# EAGLE schematic pdp8i (EAGLE 6.6.0), part 3 of 4
## Sheet 21 of 40
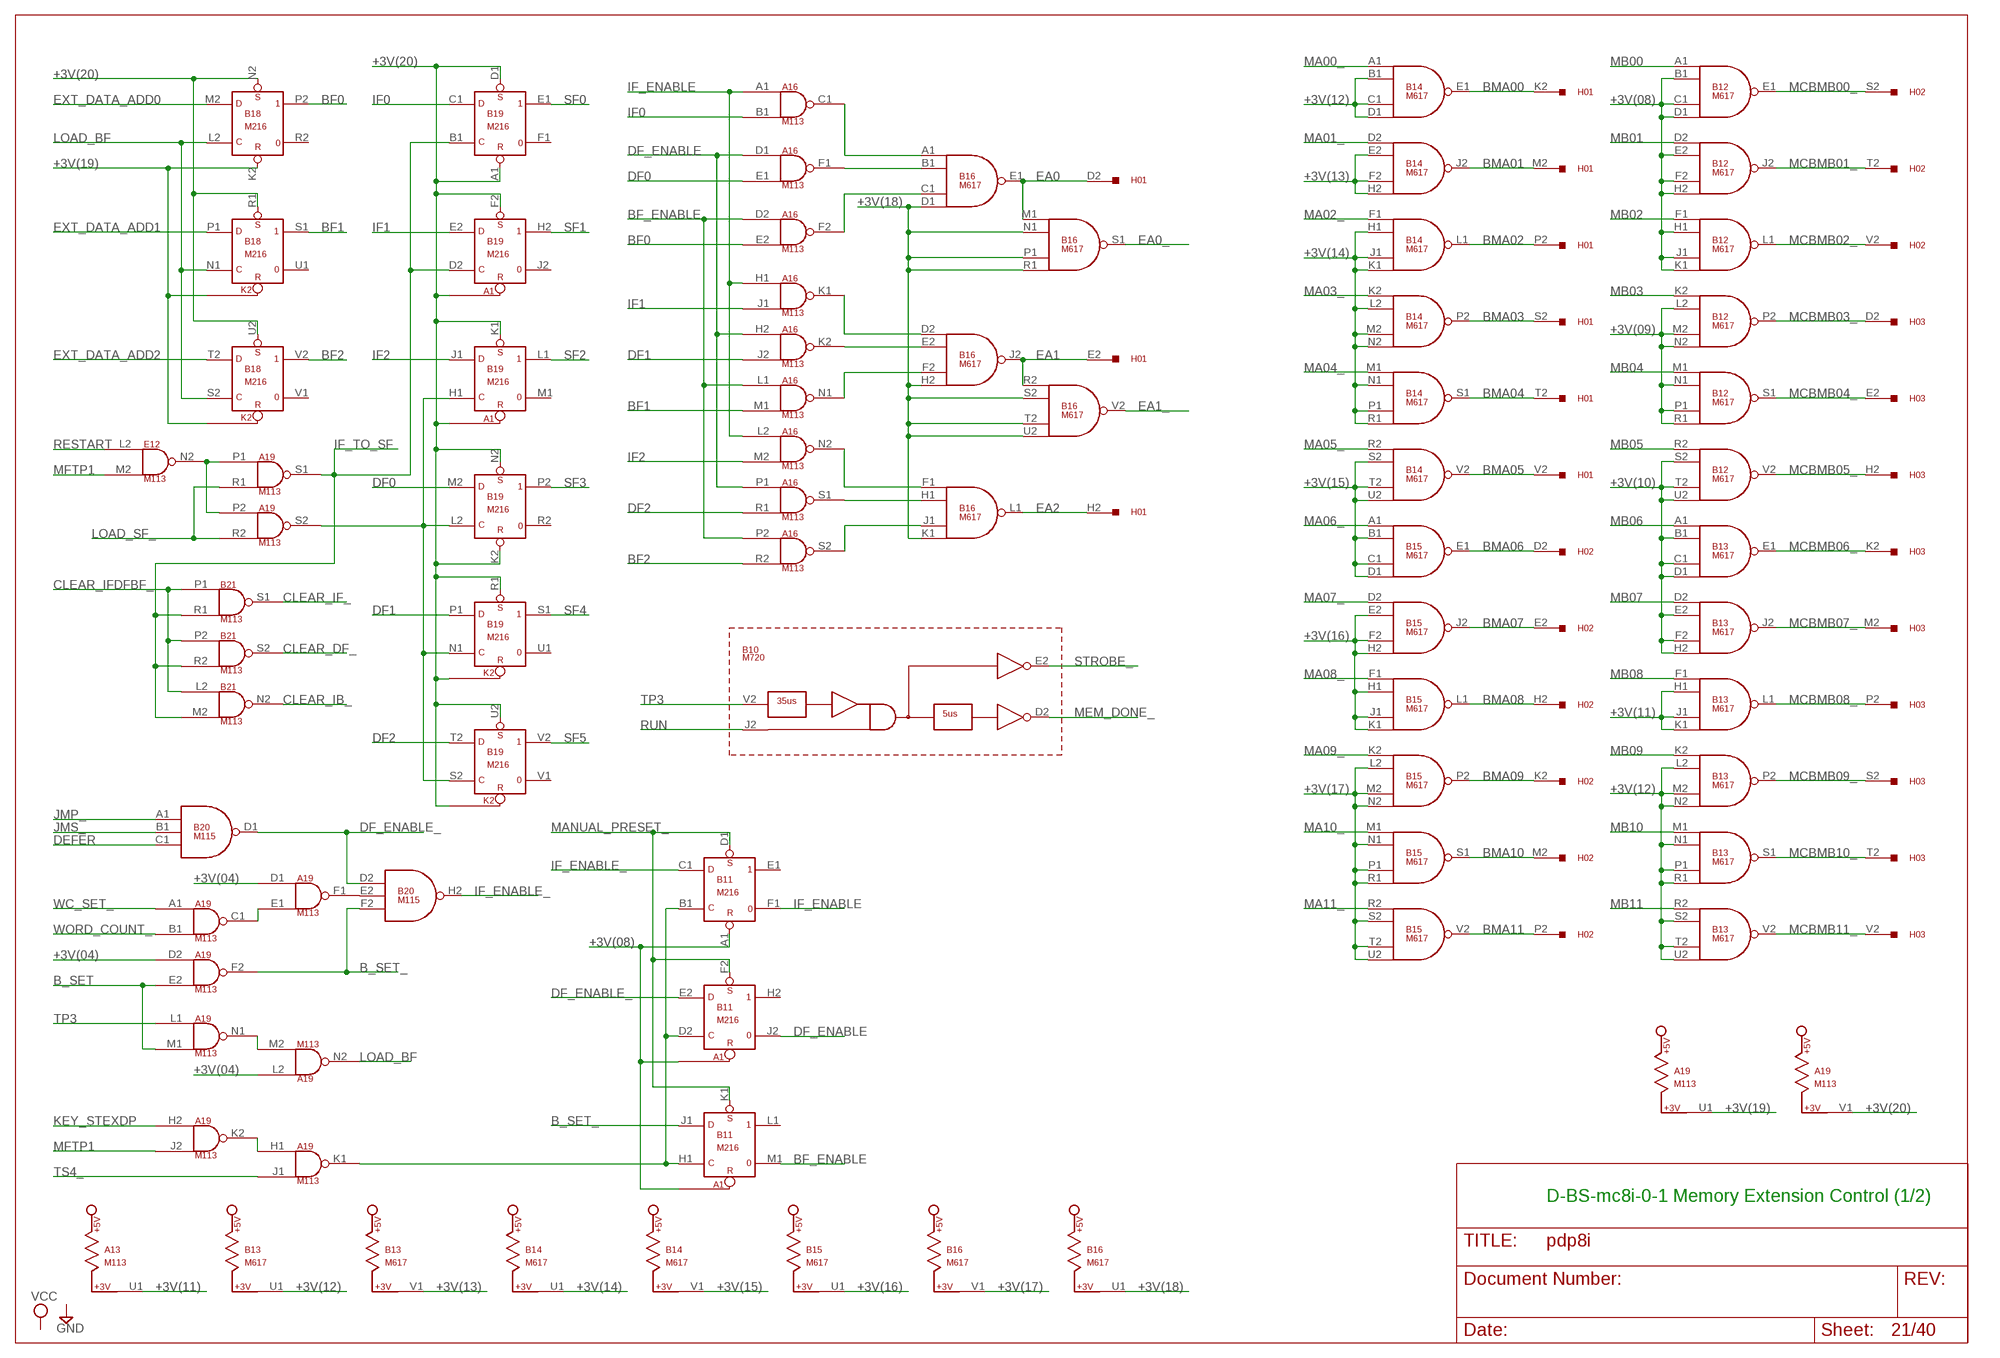
[diagram p21: schematic, sheet 21]

### Parts
A13  M113  [H807]
A16  M113  [H807]
A19  M113  [H807]
B10  M720  [H807]
B11  M216  [H807]
B12  M617  [H807]
B13  M617  [H807]
B14  M617  [H807]
B15  M617  [H807]
B16  M617  [H807]
B18  M216  [H807]
B19  M216  [H807]
B20  M115  [H807]
H01  W011  [H807]
H02  W011  [H807]
H03  W011  [H807]

### Nets
+3V(04): A19.D1(F1:IN1) A19.D2(F2:IN1) A19.L2(N2:IN1) ; also sheet 22
+3V(08): B11.A1(E1:R) B12.B1(E1:IN2) B12.C1(E1:IN3) B12.D1(E1:IN4) B12.E2(J2:IN2) B12.F2(J2:IN3) B12.H1(L1:IN2) B12.H2(J2:IN4) B12.J1(L1:IN3) B12.K1(L1:IN4) ; also sheet 22
+3V(09): B12.L2(P2:IN2) B12.M2(P2:IN3) B12.N1(S1:IN2) B12.N2(P2:IN4) B12.P1(S1:IN3) B12.R1(S1:IN4) ; also sheet 22
+3V(10): B12.S2(V2:IN2) B12.T2(V2:IN3) B12.U2(V2:IN4) B13.B1(E1:IN2) B13.C1(E1:IN3) B13.D1(E1:IN4) B13.E2(J2:IN2) B13.F2(J2:IN3) B13.H2(J2:IN4) ; also sheet 22
+3V(11): A13.U1 B13.H1(L1:IN2) B13.J1(L1:IN3) B13.K1(L1:IN4)
+3V(12): B13.L2(P2:IN2) B13.M2(P2:IN3) B13.N1(S1:IN2) B13.N2(P2:IN4) B13.P1(S1:IN3) B13.R1(S1:IN4) B13.S2(V2:IN2) B13.T2(V2:IN3) B13.U1 B13.U2(V2:IN4) B14.B1(E1:IN2) B14.C1(E1:IN3) B14.D1(E1:IN4)
+3V(13): B13.V1 B14.E2(J2:IN2) B14.F2(J2:IN3) B14.H2(J2:IN4)
+3V(14): B14.H1(L1:IN2) B14.J1(L1:IN3) B14.K1(L1:IN4) B14.L2(P2:IN2) B14.M2(P2:IN3) B14.N1(S1:IN2) B14.N2(P2:IN4) B14.P1(S1:IN3) B14.R1(S1:IN4) B14.U1
+3V(15): B14.S2(V2:IN2) B14.T2(V2:IN3) B14.U2(V2:IN4) B14.V1 B15.B1(E1:IN2) B15.C1(E1:IN3) B15.D1(E1:IN4)
+3V(16): B15.E2(J2:IN2) B15.F2(J2:IN3) B15.H1(L1:IN2) B15.H2(J2:IN4) B15.J1(L1:IN3) B15.K1(L1:IN4) B15.U1
+3V(17): B15.L2(P2:IN2) B15.M2(P2:IN3) B15.N1(S1:IN2) B15.N2(P2:IN4) B15.P1(S1:IN3) B15.R1(S1:IN4) B15.S2(V2:IN2) B15.T2(V2:IN3) B15.U2(V2:IN4) B16.V1
+3V(18): B16.D1(E1:IN4) B16.H2(J2:IN4) B16.K1(L1:IN4) B16.N1(S1:IN2) B16.P1(S1:IN3) B16.R1(S1:IN4) B16.S2(V2:IN2) B16.T2(V2:IN3) B16.U1 B16.U2(V2:IN4)
+3V(19): A19.U1 B18.K2(P2:R) ; also sheet 22
+3V(20): A19.V1 B18.N2(P2:S) B18.R1(S1:S) B18.U2(V2:S) B19.A1(E1:R) B19.D1(E1:S) B19.F2(H2:S) B19.K1(L1:S) B19.K2(P2:R) B19.N2(P2:S) B19.R1(S1:S) B19.U2(V2:S)
B_SET: A19.E2(F2:IN2) A19.M1(N1:IN2) ; also sheet 4
B_SET_: A19.F2(F2:OUT) B11.J1(L1:D) B20.F2(H2:IN3)
BF0: A16.E2(F2:IN2) B18.P2
BF1: A16.M1(N1:IN2) B18.S1
BF2: A16.R2(S2:IN2) B18.V2
BF_ENABLE: A16.D2(F2:IN1) A16.L1(N1:IN1) A16.P2(S2:IN1) B11.M1
BMA00: B14.E1(E1:OUT) H01.K2
BMA01: B14.J2(J2:OUT) H01.M2
BMA02: B14.L1(L1:OUT) H01.P2
BMA03: B14.P2(P2:OUT) H01.S2
BMA04: B14.S1(S1:OUT) H01.T2
BMA05: B14.V2(V2:OUT) H01.V2
BMA06: B15.E1(E1:OUT) H02.D2
BMA07: B15.J2(J2:OUT) H02.E2
BMA08: B15.L1(L1:OUT) H02.H2
BMA09: B15.P2(P2:OUT) H02.K2
BMA10: B15.S1(S1:OUT) H02.M2
BMA11: B15.V2(V2:OUT) H02.P2
CLEAR_DF_: B21.S2(S2:OUT) ; also sheet 22
CLEAR_IB_: B21.N2(N2:OUT) ; also sheet 22
CLEAR_IF_: B21.S1(S1:OUT) ; also sheet 22,26
CLEAR_IFDFBF_: B21.L2(N2:IN1) B21.P1(S1:IN1) B21.P2(S2:IN1) ; also sheet 8
DEFER: B20.C1(D1:IN3) ; also sheet 4,5,6,7
DF0: A16.E1(F1:IN2) B19.M2(P2:D) ; also sheet 22
DF1: A16.J2(K2:IN2) B19.P1(S1:D) ; also sheet 22
DF2: A16.R1(S1:IN2) B19.T2(V2:D) ; also sheet 22
DF_ENABLE: A16.D1(F1:IN1) A16.H2(K2:IN1) A16.P1(S1:IN1) B11.J2
DF_ENABLE_: B11.E2(H2:D) B20.D1(D1:OUT) B20.D2(H2:IN1)
EA0: B16.E1(E1:OUT) B16.M1(S1:IN1) H01.D2
EA0_: B16.S1(S1:OUT) ; also sheet 17
EA1: B16.J2(J2:OUT) B16.R2(V2:IN1) H01.E2
EA1_: B16.V2(V2:OUT) ; also sheet 17
EA2: B16.L1(L1:OUT) H01.H2 ; also sheet 17
EXT_DATA_ADD0: B18.M2(P2:D) ; also sheet 14
EXT_DATA_ADD1: B18.P1(S1:D) ; also sheet 14
EXT_DATA_ADD2: B18.T2(V2:D) ; also sheet 14
IF0: A16.B1(C1:IN2) B19.C1(E1:D) ; also sheet 22
IF1: A16.J1(K1:IN2) B19.E2(H2:D) ; also sheet 22
IF2: A16.M2(N2:IN2) B19.J1(L1:D) ; also sheet 22
IF_ENABLE: A16.A1(C1:IN1) A16.H1(K1:IN1) A16.L2(N2:IN1) B11.F1
IF_ENABLE_: B11.C1(E1:D) B20.H2(H2:OUT)
IF_TO_SF: A19.S1(S1:OUT) B19.B1(E1:C) B19.D2(H2:C) B21.M2(N2:IN2) B21.R1(S1:IN2) B21.R2(S2:IN2) ; also sheet 26
JMP_: B20.A1(D1:IN1) ; also sheet 4,5,22
JMS_: B20.B1(D1:IN2) ; also sheet 4,22
KEY_STEXDP: A19.H2(K2:IN1) ; also sheet 2,5,7
LOAD_BF: A19.N2(N2:OUT) B18.L2(P2:C) B18.N1(S1:C) B18.S2(V2:C)
LOAD_SF_: A19.R1(S1:IN2) A19.R2(S2:IN2) ; also sheet 8
MA00_: B14.A1(E1:IN1) ; also sheet 6,9,19,24
MA01_: B14.D2(J2:IN1) ; also sheet 6,9
MA02_: B14.F1(L1:IN1) ; also sheet 6,9
MA03_: B14.K2(P2:IN1) ; also sheet 6,9,19,24
MA04_: B14.M1(S1:IN1) ; also sheet 6,9
MA05_: B14.R2(V2:IN1) ; also sheet 6,9
MA06_: B15.A1(E1:IN1) ; also sheet 6,9,20,25
MA07_: B15.D2(J2:IN1) ; also sheet 6,9
MA08_: B15.F1(L1:IN1) ; also sheet 9
MA09_: B15.K2(P2:IN1) ; also sheet 9,20,25
MA10_: B15.M1(S1:IN1) ; also sheet 9
MA11_: B15.R2(V2:IN1) ; also sheet 9
MANUAL_PRESET_: B11.D1(E1:S) B11.F2(H2:S) B11.K1(L1:S) ; also sheet 2,4,8,29
MB00: B12.A1(E1:IN1) ; also sheet 9,14,30
MB01: B12.D2(J2:IN1) ; also sheet 9,14,30
MB02: B12.F1(L1:IN1) ; also sheet 9,14,30
MB03: B12.K2(P2:IN1) ; also sheet 4,5,9,14,27,29,30,34,38
MB04: B12.M1(S1:IN1) ; also sheet 5,9,14,22,30,38
MB05: B12.R2(V2:IN1) ; also sheet 5,7,9,14,27,30,32,34,37
MB06: B13.A1(E1:IN1) ; also sheet 5,7,9,14,16,22,27,30,33,38
MB07: B13.D2(J2:IN1) ; also sheet 5,7,9,14,15,22,26,27,30,33,34,35,37,38
MB08: B13.F1(L1:IN1) ; also sheet 6,7,9,14,15,22,26,27,30,33,34,36,37,38
MB09: B13.K2(P2:IN1) ; also sheet 2,5,6,9,14,22,27,29,30,37
MB10: B13.M1(S1:IN1) ; also sheet 2,6,8,9,14,22,27,29,30,33,37
MB11: B13.R2(V2:IN1) ; also sheet 2,6,9,14,22,27,29,30,33,37
MCBMB00_: B12.E1(E1:OUT) H02.S2
MCBMB01_: B12.J2(J2:OUT) H02.T2
MCBMB02_: B12.L1(L1:OUT) H02.V2
MCBMB03_: B12.P2(P2:OUT) H03.D2
MCBMB04_: B12.S1(S1:OUT) H03.E2
MCBMB05_: B12.V2(V2:OUT) H03.H2
MCBMB06_: B13.E1(E1:OUT) H03.K2
MCBMB07_: B13.J2(J2:OUT) H03.M2
MCBMB08_: B13.L1(L1:OUT) H03.P2
MCBMB09_: B13.P2(P2:OUT) H03.S2
MCBMB10_: B13.S1(S1:OUT) H03.T2
MCBMB11_: B13.V2(V2:OUT) H03.V2
MEM_DONE_: B10.D2 ; also sheet 2,8,17,29
MFTP1: A19.J2(K2:IN2) E12.M2(N2:IN2) ; also sheet 2,7
N$53: A19.P1(S1:IN1) A19.P2(S2:IN1) E12.N2(N2:OUT)
N$263: A19.C1(C1:OUT) A19.E1(F1:IN2)
N$264: A19.S2(S2:OUT) B19.H1(L1:C) B19.L2(P2:C) B19.N1(S1:C) B19.S2(V2:C)
N$403: A19.F1(F1:OUT) B20.E2(H2:IN2)
N$407: A19.M2(N2:IN2) A19.N1(N1:OUT)
N$408: A19.H1(K1:IN1) A19.K2(K2:OUT)
N$409: A16.F2(F2:OUT) B16.C1(E1:IN3)
N$410: A16.F1(F1:OUT) B16.B1(E1:IN2)
N$411: A16.C1(C1:OUT) B16.A1(E1:IN1)
N$412: A19.K1(K1:OUT) B11.B1(E1:C) B11.D2(H2:C) B11.H1(L1:C)
N$413: A16.K1(K1:OUT) B16.D2(J2:IN1)
N$414: A16.K2(K2:OUT) B16.E2(J2:IN2)
N$415: A16.N1(N1:OUT) B16.F2(J2:IN3)
N$416: A16.N2(N2:OUT) B16.F1(L1:IN1)
N$417: A16.S1(S1:OUT) B16.H1(L1:IN2)
N$418: A16.S2(S2:OUT) B16.J1(L1:IN3)
RESTART: E12.L2(N2:IN1) ; also sheet 32
RUN: B10.J2 ; also sheet 2
SF0: B19.E1 ; also sheet 22
SF1: B19.H2 ; also sheet 22
SF2: B19.L1 ; also sheet 22
SF3: B19.P2 ; also sheet 22
SF4: B19.S1 ; also sheet 22
SF5: B19.V2 ; also sheet 22
STROBE_: B10.E2 ; also sheet 2,8,17
TP3: A19.L1(N1:IN1) B10.V2 ; also sheet 2,7,22,26,27,29,30
TS4_: A19.J1(K1:IN2) ; also sheet 2
WC_SET_: A19.A1(C1:IN1) ; also sheet 4
WORD_COUNT_: A19.B1(C1:IN2) ; also sheet 4,8
Unconnected: A13.V1 A16.U1 A16.V1 B10.S2(IN1) B10.T2(IN2) B10.U2(OUT) B11.E1 B11.H2 B11.K2(P2:R) B11.L1 B11.L2(P2:C) B11.M2(P2:D) B11.N1(S1:C) B11.N2(P2:S) B11.P1(S1:D) B11.P2 B11.R1(S1:S) B11.R2 B11.S1 B11.S2(V2:C) B11.T2(V2:D) B11.U1 B11.U2(V2:S) B11.V1 B11.V2 B12.U1 B12.V1 B15.V1 B18.R2 B18.U1 B18.V1 B19.F1 B19.J2 B19.M1 B19.R2 B19.U1 B19.V1

### Notes on the sheet
- D-BS-mc8i-0-1 Memory Extension Control (1/2)

## Sheet 22 of 40
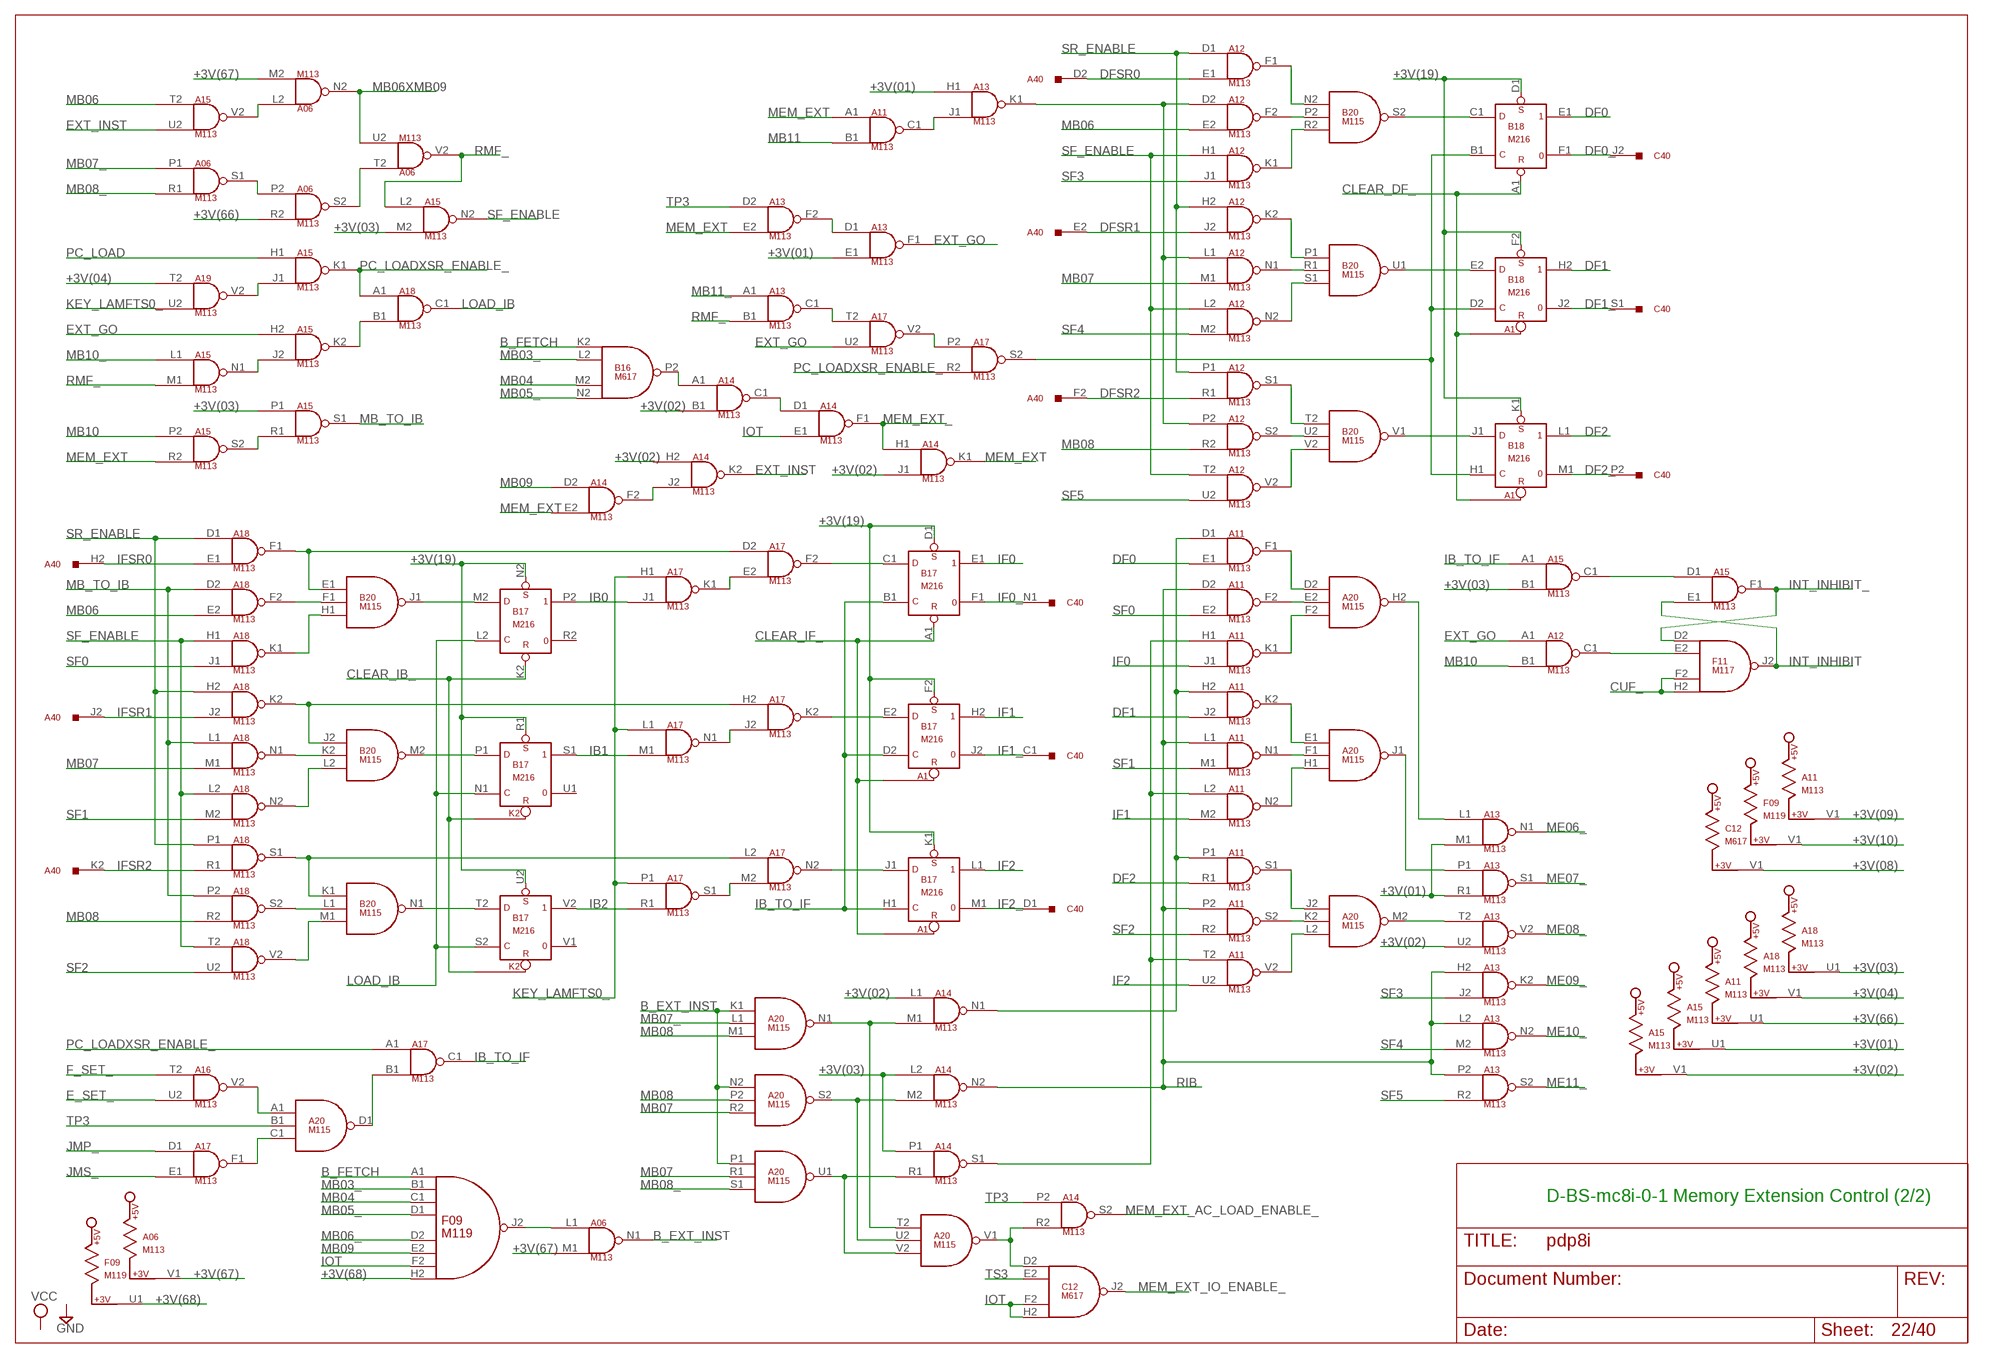
[diagram p22: schematic, sheet 22]

### Parts
A11  M113  [H807]
A12  M113  [H807]
A14  M113  [H807]
A15  M113  [H807]
A17  M113  [H807]
A18  M113  [H807]
A20  M115  [H807]
B17  M216  [H807]

### Nets
+3V(01): A13.E1(F1:IN2) A13.H1(K1:IN1) A13.M1(N1:IN2) A13.R1(S1:IN2) A15.U1
+3V(02): A13.U2(V2:IN2) A14.B1(C1:IN2) A14.H2(K2:IN1) A14.J1(K1:IN2) A14.L1(N1:IN1) A15.V1
+3V(03): A14.L2(N2:IN1) A14.P1(S1:IN1) A15.B1(C1:IN2) A15.M2(N2:IN2) A15.P1(S1:IN1) A18.U1
+3V(04): A18.V1 A19.T2(V2:IN1) ; also sheet 21
+3V(08): C12.V1 ; also sheet 21
+3V(09): A11.V1 ; also sheet 21
+3V(10): F09.V1 ; also sheet 21
+3V(19): B17.D1(E1:S) B17.F2(H2:S) B17.K1(L1:S) B17.N2(P2:S) B17.R1(S1:S) B17.U2(V2:S) B18.D1(E1:S) B18.F2(H2:S) B18.K1(L1:S) ; also sheet 21
+3V(66): A06.R2(S2:IN2) A11.U1 ; also sheet 26
+3V(67): A06.M1(N1:IN2) A06.M2(N2:IN2) A06.V1 ; also sheet 26
+3V(68): F09.H2(J2:IN8) F09.U1 ; also sheet 2
B_EXT_INST: A06.N1(N1:OUT) A20.K1(N1:IN1) A20.N2(S2:IN1) A20.P1(U1:IN1) ; also sheet 26
B_FETCH: B16.K2(P2:IN1) F09.A1(J2:IN1) ; also sheet 2,4,5,6,7,8,27,29
CLEAR_DF_: B18.A1(E1:R) ; also sheet 21
CLEAR_IB_: B17.K2(P2:R) ; also sheet 21
CLEAR_IF_: B17.A1(E1:R) ; also sheet 21,26
CUF_: F11.F2(J2:IN3) F11.H2(J2:IN4) ; also sheet 26
DF0: A11.E1(F1:IN2) B18.E1 ; also sheet 21
DF0_: B18.F1 C40.J2
DF1: A11.J2(K2:IN2) B18.H2 ; also sheet 21
DF1_: B18.J2 C40.S1
DF2: A11.R1(S1:IN2) B18.L1 ; also sheet 21
DF2_: B18.M1 C40.P2
DFSR0: A12.E1(F1:IN2) A40.D2
DFSR1: A12.J2(K2:IN2) A40.E2
DFSR2: A12.R1(S1:IN2) A40.F2
E_SET_: A16.U2(V2:IN2) ; also sheet 4,5
EXT_GO: A12.A1(C1:IN1) A13.F1(F1:OUT) A15.H2(K2:IN1) A17.U2(V2:IN2) ; also sheet 26
EXT_INST: A14.K2(K2:OUT) A15.U2(V2:IN2)
F_SET_: A16.T2(V2:IN1) ; also sheet 4,5
IB0: A17.J1(K1:IN2) B17.P2
IB1: A17.M1(N1:IN2) B17.S1
IB2: A17.R1(S1:IN2) B17.V2
IB_TO_IF: A15.A1(C1:IN1) A17.C1(C1:OUT) B17.B1(E1:C) B17.D2(H2:C) B17.H1(L1:C) ; also sheet 26
IF0: A11.J1(K1:IN2) B17.E1 ; also sheet 21
IF0_: B17.F1 C40.N1
IF1: A11.M2(N2:IN2) B17.H2 ; also sheet 21
IF1_: B17.J2 C40.C1
IF2: A11.U2(V2:IN2) B17.L1 ; also sheet 21
IF2_: B17.M1 C40.D1
IFSR0: A18.E1(F1:IN2) A40.H2
IFSR1: A18.J2(K2:IN2) A40.J2
IFSR2: A18.R1(S1:IN2) A40.K2
INT_INHIBIT: A15.E1(F1:IN2) F11.J2(J2:OUT)
INT_INHIBIT_: A15.F1(F1:OUT) F11.D2(J2:IN1) ; also sheet 8
IOT: A14.E1(F1:IN2) C12.F2(J2:IN3) C12.H2(J2:IN4) F09.F2(J2:IN7) ; also sheet 2,4,7,8,29
JMP_: A17.D1(F1:IN1) ; also sheet 4,5,21
JMS_: A17.E1(F1:IN2) ; also sheet 4,21
KEY_LAMFTS0_: A17.H1(K1:IN1) A17.L1(N1:IN1) A17.P1(S1:IN1) A19.U2(V2:IN2) ; also sheet 5,26
LOAD_IB: A18.C1(C1:OUT) B17.L2(P2:C) B17.N1(S1:C) B17.S2(V2:C)
MB03_: B16.L2(P2:IN2) F09.B1(J2:IN2) ; also sheet 4,5,6,7,8,9,14,15,16,18,23,30,32,33,35,36,37
MB04: B16.M2(P2:IN3) F09.C1(J2:IN3) ; also sheet 5,9,14,21,30,38
MB05_: B16.N2(P2:IN4) F09.D1(J2:IN4) ; also sheet 5,8,9,14,15,16,18,23,29,30,33,35,36,38
MB06: A12.E2(F2:IN2) A15.T2(V2:IN1) A18.E2(F2:IN2) ; also sheet 5,7,9,14,16,21,27,30,33,38
MB06_: F09.D2(J2:IN5) ; also sheet 5,8,9,14,15,18,23,29,30,32,34,35,36,37,38
MB06XMB09: A06.N2(N2:OUT) A06.U2(V2:IN2) ; also sheet 26
MB07: A12.M1(N1:IN2) A18.M1(N1:IN2) A20.R1(U1:IN2) A20.R2(S2:IN3) ; also sheet 5,7,9,14,15,21,26,27,30,33,34,35,37,38
MB07_: A06.P1(S1:IN1) A20.L1(N1:IN2) ; also sheet 5,8,9,14,16,18,23,26,28,29,30,32,33,34,36
MB08: A12.R2(S2:IN2) A18.R2(S2:IN2) A20.M1(N1:IN3) A20.P2(S2:IN2) ; also sheet 6,7,9,14,15,21,26,27,30,33,34,36,37,38
MB08_: A06.R1(S1:IN2) A20.S1(U1:IN3) ; also sheet 6,7,8,9,14,16,18,23,26,28,29,30,32,33,34,35
MB09: A14.D2(F2:IN1) F09.E2(J2:IN6) ; also sheet 2,5,6,9,14,21,27,29,30,37
MB10: A12.B1(C1:IN2) A15.P2(S2:IN1) ; also sheet 2,6,8,9,14,21,27,29,30,33,37
MB10_: A15.L1(N1:IN1) ; also sheet 6,8,9,18,23,26,27,28,30,37
MB11: A11.B1(C1:IN2) ; also sheet 2,6,9,14,21,27,29,30,33,37
MB11_: A13.A1(C1:IN1) ; also sheet 2,5,7,8,9,18,23,26,28,29,30
MB_TO_IB: A15.S1(S1:OUT) A18.D2(F2:IN1) A18.L1(N1:IN1) A18.P2(S2:IN1)
ME06_: A13.N1(N1:OUT) ; also sheet 14
ME07_: A13.S1(S1:OUT) ; also sheet 14
ME08_: A13.V2(V2:OUT) ; also sheet 14
ME09_: A13.K2(K2:OUT) ; also sheet 14
ME10_: A13.N2(N2:OUT) ; also sheet 14
ME11_: A13.S2(S2:OUT) ; also sheet 14
MEM_EXT: A11.A1(C1:IN1) A13.E2(F2:IN2) A14.E2(F2:IN2) A14.K1(K1:OUT) A15.R2(S2:IN2)
MEM_EXT_: A14.F1(F1:OUT) A14.H1(K1:IN1) ; also sheet 2
MEM_EXT_AC_LOAD_ENABLE_: A14.S2(S2:OUT) ; also sheet 7
MEM_EXT_IO_ENABLE_: C12.J2(J2:OUT) ; also sheet 5
N$420: A06.P2(S2:IN1) A06.S1(S1:OUT)
N$421: A06.L2(N2:IN1) A15.V2(V2:OUT)
N$422: A06.S2(S2:OUT) A06.T2(V2:IN1)
N$423: A15.R1(S1:IN2) A15.S2(S2:OUT)
N$424: A15.J2(K2:IN2) A15.N1(N1:OUT)
N$425: A15.J1(K1:IN2) A19.V2(V2:OUT)
N$426: A15.K2(K2:OUT) A18.B1(C1:IN2)
N$427: A18.F2(F2:OUT) B20.F1(J1:IN2)
N$428: A18.K1(K1:OUT) B20.H1(J1:IN3)
N$429: A17.D2(F2:IN1) A18.F1(F1:OUT) B20.E1(J1:IN1)
N$430: A17.H2(K2:IN1) A18.K2(K2:OUT) B20.J2(M2:IN1)
N$431: A18.N1(N1:OUT) B20.K2(M2:IN2)
N$432: A18.N2(N2:OUT) B20.L2(M2:IN3)
N$433: A17.L2(N2:IN1) A18.S1(S1:OUT) B20.K1(N1:IN1)
N$434: A18.S2(S2:OUT) B20.L1(N1:IN2)
N$435: A18.V2(V2:OUT) B20.M1(N1:IN3)
N$436: B17.T2(V2:D) B20.N1(N1:OUT)
N$437: B17.P1(S1:D) B20.M2(M2:OUT)
N$438: B17.M2(P2:D) B20.J1(J1:OUT)
N$439: A17.E2(F2:IN2) A17.K1(K1:OUT)
N$440: A17.J2(K2:IN2) A17.N1(N1:OUT)
N$441: A17.M2(N2:IN2) A17.S1(S1:OUT)
N$442: A17.N2(N2:OUT) B17.J1(L1:D)
N$443: A17.K2(K2:OUT) B17.E2(H2:D)
N$444: A17.F2(F2:OUT) B17.C1(E1:D)
N$445: A16.V2(V2:OUT) A20.A1(D1:IN1)
N$446: A17.F1(F1:OUT) A20.C1(D1:IN3)
N$447: A17.B1(C1:IN2) A20.D1(D1:OUT)
N$451: A06.L1(N1:IN1) F09.J2(J2:OUT)
N$452: A14.A1(C1:IN1) B16.P2(P2:OUT)
N$453: A14.C1(C1:OUT) A14.D1(F1:IN1)
N$454: A14.F2(F2:OUT) A14.J2(K2:IN2)
N$455: A14.M1(N1:IN2) A20.N1(N1:OUT) A20.T2(V1:IN1)
N$456: A14.M2(N2:IN2) A20.S2(S2:OUT) A20.U2(V1:IN2)
N$457: A14.R1(S1:IN2) A20.U1(U1:OUT) A20.V2(V1:IN3)
N$458: A14.R2(S2:IN2) A20.V1(V1:OUT) C12.D2(J2:IN1)
N$459: A11.D1(F1:IN1) A11.H2(K2:IN1) A11.P1(S1:IN1) A14.N1(N1:OUT)
N$460: A11.H1(K1:IN1) A11.L2(N2:IN1) A11.T2(V2:IN1) A14.S1(S1:OUT)
N$461: A11.S2(S2:OUT) A20.K2(M2:IN2)
N$462: A11.N1(N1:OUT) A20.F1(J1:IN2)
N$463: A11.F2(F2:OUT) A20.E2(H2:IN2)
N$464: A11.F1(F1:OUT) A20.D2(H2:IN1)
N$465: A11.K1(K1:OUT) A20.F2(H2:IN3)
N$466: A11.N2(N2:OUT) A20.H1(J1:IN3)
N$467: A11.V2(V2:OUT) A20.L2(M2:IN3)
N$468: A11.S1(S1:OUT) A20.J2(M2:IN1)
N$469: A11.K2(K2:OUT) A20.E1(J1:IN1)
N$470: A13.L1(N1:IN1) A20.H2(H2:OUT)
N$471: A13.P1(S1:IN1) A20.J1(J1:OUT)
N$472: A13.T2(V2:IN1) A20.M2(M2:OUT)
N$473: A12.D2(F2:IN1) A12.L1(N1:IN1) A12.P2(S2:IN1) A13.K1(K1:OUT)
N$474: A12.S2(S2:OUT) B20.U2(V1:IN2)
N$475: A12.V2(V2:OUT) B20.V2(V1:IN3)
N$476: A12.N2(N2:OUT) B20.S1(U1:IN3)
N$477: A12.N1(N1:OUT) B20.R1(U1:IN2)
N$478: A12.K2(K2:OUT) B20.P1(U1:IN1)
N$479: A12.S1(S1:OUT) B20.T2(V1:IN1)
N$480: A12.K1(K1:OUT) B20.R2(S2:IN3)
N$481: A12.F2(F2:OUT) B20.P2(S2:IN2)
N$482: A12.F1(F1:OUT) B20.N2(S2:IN1)
N$483: B18.C1(E1:D) B20.S2(S2:OUT)
N$484: B18.E2(H2:D) B20.U1(U1:OUT)
N$485: B18.J1(L1:D) B20.V1(V1:OUT)
N$489: A17.S2(S2:OUT) B18.B1(E1:C) B18.D2(H2:C) B18.H1(L1:C)
N$490: A11.C1(C1:OUT) A13.J1(K1:IN2)
N$491: A17.P2(S2:IN1) A17.V2(V2:OUT)
N$492: A13.D1(F1:IN1) A13.F2(F2:OUT)
N$493: A13.C1(C1:OUT) A17.T2(V2:IN1)
N$494: A15.C1(C1:OUT) A15.D1(F1:IN1)
N$497: A12.C1(C1:OUT) F11.E2(J2:IN2)
PC_LOAD: A15.H1(K1:IN1) ; also sheet 7,9
PC_LOADXSR_ENABLE_: A15.K1(K1:OUT) A17.A1(C1:IN1) A17.R2(S2:IN2) A18.A1(C1:IN1) ; also sheet 26
RIB: A11.D2(F2:IN1) A11.L1(N1:IN1) A11.P2(S2:IN1) A13.H2(K2:IN1) A13.L2(N2:IN1) A13.P2(S2:IN1) A14.N2(N2:OUT) ; also sheet 26
RMF_: A06.V2(V2:OUT) A13.B1(C1:IN2) A15.L2(N2:IN1) A15.M1(N1:IN2) ; also sheet 26
SF0: A11.E2(F2:IN2) A18.J1(K1:IN2) ; also sheet 21
SF1: A11.M1(N1:IN2) A18.M2(N2:IN2) ; also sheet 21
SF2: A11.R2(S2:IN2) A18.U2(V2:IN2) ; also sheet 21
SF3: A12.J1(K1:IN2) A13.J2(K2:IN2) ; also sheet 21
SF4: A12.M2(N2:IN2) A13.M2(N2:IN2) ; also sheet 21
SF5: A12.U2(V2:IN2) A13.R2(S2:IN2) ; also sheet 21
SF_ENABLE: A12.H1(K1:IN1) A12.L2(N2:IN1) A12.T2(V2:IN1) A15.N2(N2:OUT) A18.H1(K1:IN1) A18.L2(N2:IN1) A18.T2(V2:IN1) ; also sheet 26
SR_ENABLE: A12.D1(F1:IN1) A12.H2(K2:IN1) A12.P1(S1:IN1) A18.D1(F1:IN1) A18.H2(K2:IN1) A18.P1(S1:IN1) ; also sheet 5,10,11,12,13
TP3: A13.D2(F2:IN1) A14.P2(S2:IN1) A20.B1(D1:IN2) ; also sheet 2,7,21,26,27,29,30
TS3: C12.E2(J2:IN2) ; also sheet 2,5,6,29
Unconnected: A12.U1 A12.V1 A14.T2(V2:IN1) A14.U1 A14.U2(V2:IN2) A14.V1 A14.V2(V2:OUT) A15.D2(F2:IN1) A15.E2(F2:IN2) A15.F2(F2:OUT) A17.U1 A17.V1 B17.R2 B17.U1 B17.V1

### Notes on the sheet
- D-BS-mc8i-0-1 Memory Extension Control (2/2)

## Sheet 23 of 40
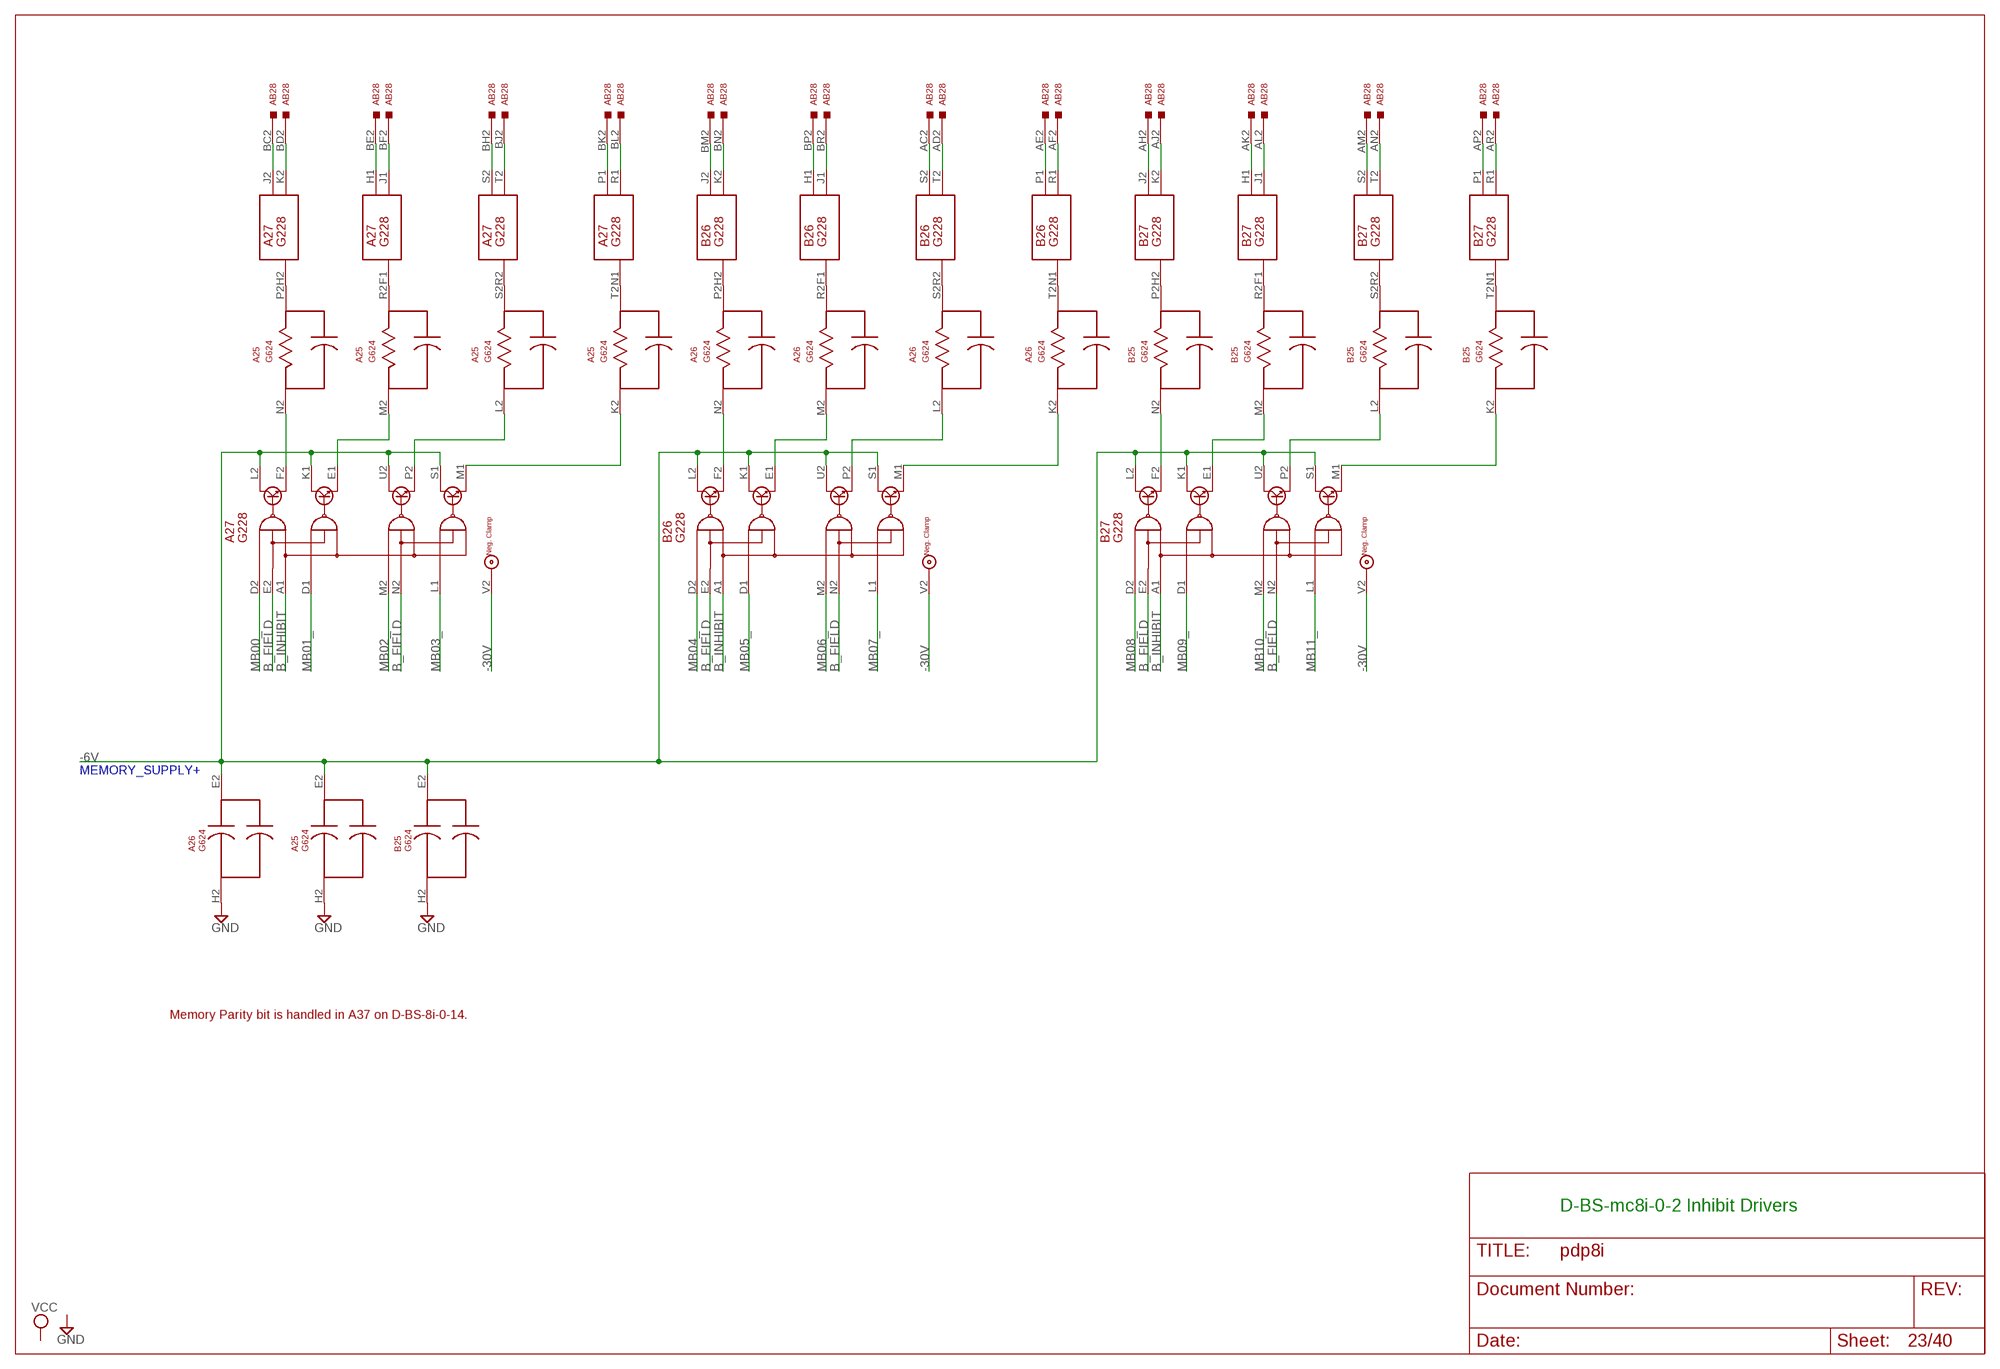
[diagram p23: schematic, sheet 23]

### Parts
A25  G624  [H807]
A26  G624  [H807]
A27  G228  [H807]
B25  G624  [H807]
B26  G228  [H807]
B27  G228  [H807]

### Nets
-6V [Suppply]: A25.E2 A26.E2 A27.K1 A27.L2 A27.S1 A27.U2 B25.E2 B26.K1 B26.L2 B26.S1 B26.U2 B27.K1 B27.L2 B27.S1 B27.U2 ; also sheet 17,18
-30V [Suppply]: A27.V2 B26.V2 B27.V2 ; also sheet 15,17,18,33
B_FIELD: A27.E2 A27.N2 B26.E2 B26.N2 B27.E2 B27.N2 ; also sheet 17,18,24,25
B_INHIBIT: A27.A1 B26.A1 B27.A1 ; also sheet 17,18
GND [Suppply]: A25.H2 A26.H2 B25.H2 ; also sheet 2,5,9,10,11,12,13,14,15,17,18,26,27,30,33,34,35,39
MB00_: A27.D2 ; also sheet 9,18,30
MB01_: A27.D1 ; also sheet 9,18,30
MB02_: A27.M2 ; also sheet 9,18,30
MB03_: A27.L1 ; also sheet 4,5,6,7,8,9,14,15,16,18,22,30,32,33,35,36,37
MB04_: B26.D2 ; also sheet 5,8,9,14,15,16,18,27,29,30,32,33,34,35,36,37
MB05_: B26.D1 ; also sheet 5,8,9,14,15,16,18,22,29,30,33,35,36,38
MB06_: B26.M2 ; also sheet 5,8,9,14,15,18,22,29,30,32,34,35,36,37,38
MB07_: B26.L1 ; also sheet 5,8,9,14,16,18,22,26,28,29,30,32,33,34,36
MB08_: B27.D2 ; also sheet 6,7,8,9,14,16,18,22,26,28,29,30,32,33,34,35
MB09_: B27.D1 ; also sheet 6,9,18,26,27,28,30,33,37
MB10_: B27.M2 ; also sheet 6,8,9,18,22,26,27,28,30,37
MB11_: B27.L1 ; also sheet 2,5,7,8,9,18,22,26,28,29,30
N$495: A25.P2 A27.H2(H2:H)
N$496: A25.R2 A27.F1(F1:H)
N$498: A25.S2 A27.R2(R2:H)
N$499: A25.T2 A27.N1(N1:H)
N$500: A25.N2 A27.F2
N$501: A25.M2 A27.E1
N$502: A25.L2 A27.P2
N$503: A25.K2 A27.M1
N$504: A27.J2(H2:J) AB28.BC2
N$505: A27.K2(H2:K) AB28.BD2
N$506: A26.P2 B26.H2(H2:H)
N$507: A26.R2 B26.F1(F1:H)
N$508: A26.S2 B26.R2(R2:H)
N$509: A26.T2 B26.N1(N1:H)
N$510: A26.N2 B26.F2
N$511: A26.M2 B26.E1
N$512: A26.L2 B26.P2
N$513: A26.K2 B26.M1
N$514: B25.P2 B27.H2(H2:H)
N$515: B25.R2 B27.F1(F1:H)
N$516: B25.S2 B27.R2(R2:H)
N$517: B25.T2 B27.N1(N1:H)
N$518: B25.N2 B27.F2
N$519: B25.M2 B27.E1
N$520: B25.L2 B27.P2
N$521: B25.K2 B27.M1
N$522: A27.H1(F1:J) AB28.BE2
N$523: A27.J1(F1:K) AB28.BF2
N$524: A27.S2(R2:J) AB28.BH2
N$525: A27.T2(R2:K) AB28.BJ2
N$526: A27.P1(N1:J) AB28.BK2
N$527: A27.R1(N1:K) AB28.BL2
N$528: AB28.BM2 B26.J2(H2:J)
N$529: AB28.BN2 B26.K2(H2:K)
N$530: AB28.BP2 B26.H1(F1:J)
N$531: AB28.BR2 B26.J1(F1:K)
N$532: AB28.AC2 B26.S2(R2:J)
N$533: AB28.AD2 B26.T2(R2:K)
N$534: AB28.AE2 B26.P1(N1:J)
N$535: AB28.AF2 B26.R1(N1:K)
N$536: AB28.AH2 B27.J2(H2:J)
N$537: AB28.AJ2 B27.K2(H2:K)
N$538: AB28.AK2 B27.H1(F1:J)
N$539: AB28.AL2 B27.J1(F1:K)
N$540: AB28.AM2 B27.S2(R2:J)
N$541: AB28.AN2 B27.T2(R2:K)
N$542: AB28.AP2 B27.P1(N1:J)
N$543: AB28.AR2 B27.R1(N1:K)
Unconnected: A25.B2 A25.C2 A25.D2 A25.F2 A25.J2 A25.U2 A25.V2 A26.B2 A26.C2 A26.D2 A26.F2 A26.J2 A26.U2 A26.V2 B25.B2 B25.C2 B25.D2 B25.F2 B25.J2 B25.U2 B25.V2

### Notes on the sheet
- MEMORY_SUPPLY+
- Memory Parity bit is handled in A37 on D-BS-8i-0-14.
- D-BS-mc8i-0-2 Inhibit Drivers

## Sheet 24 of 40
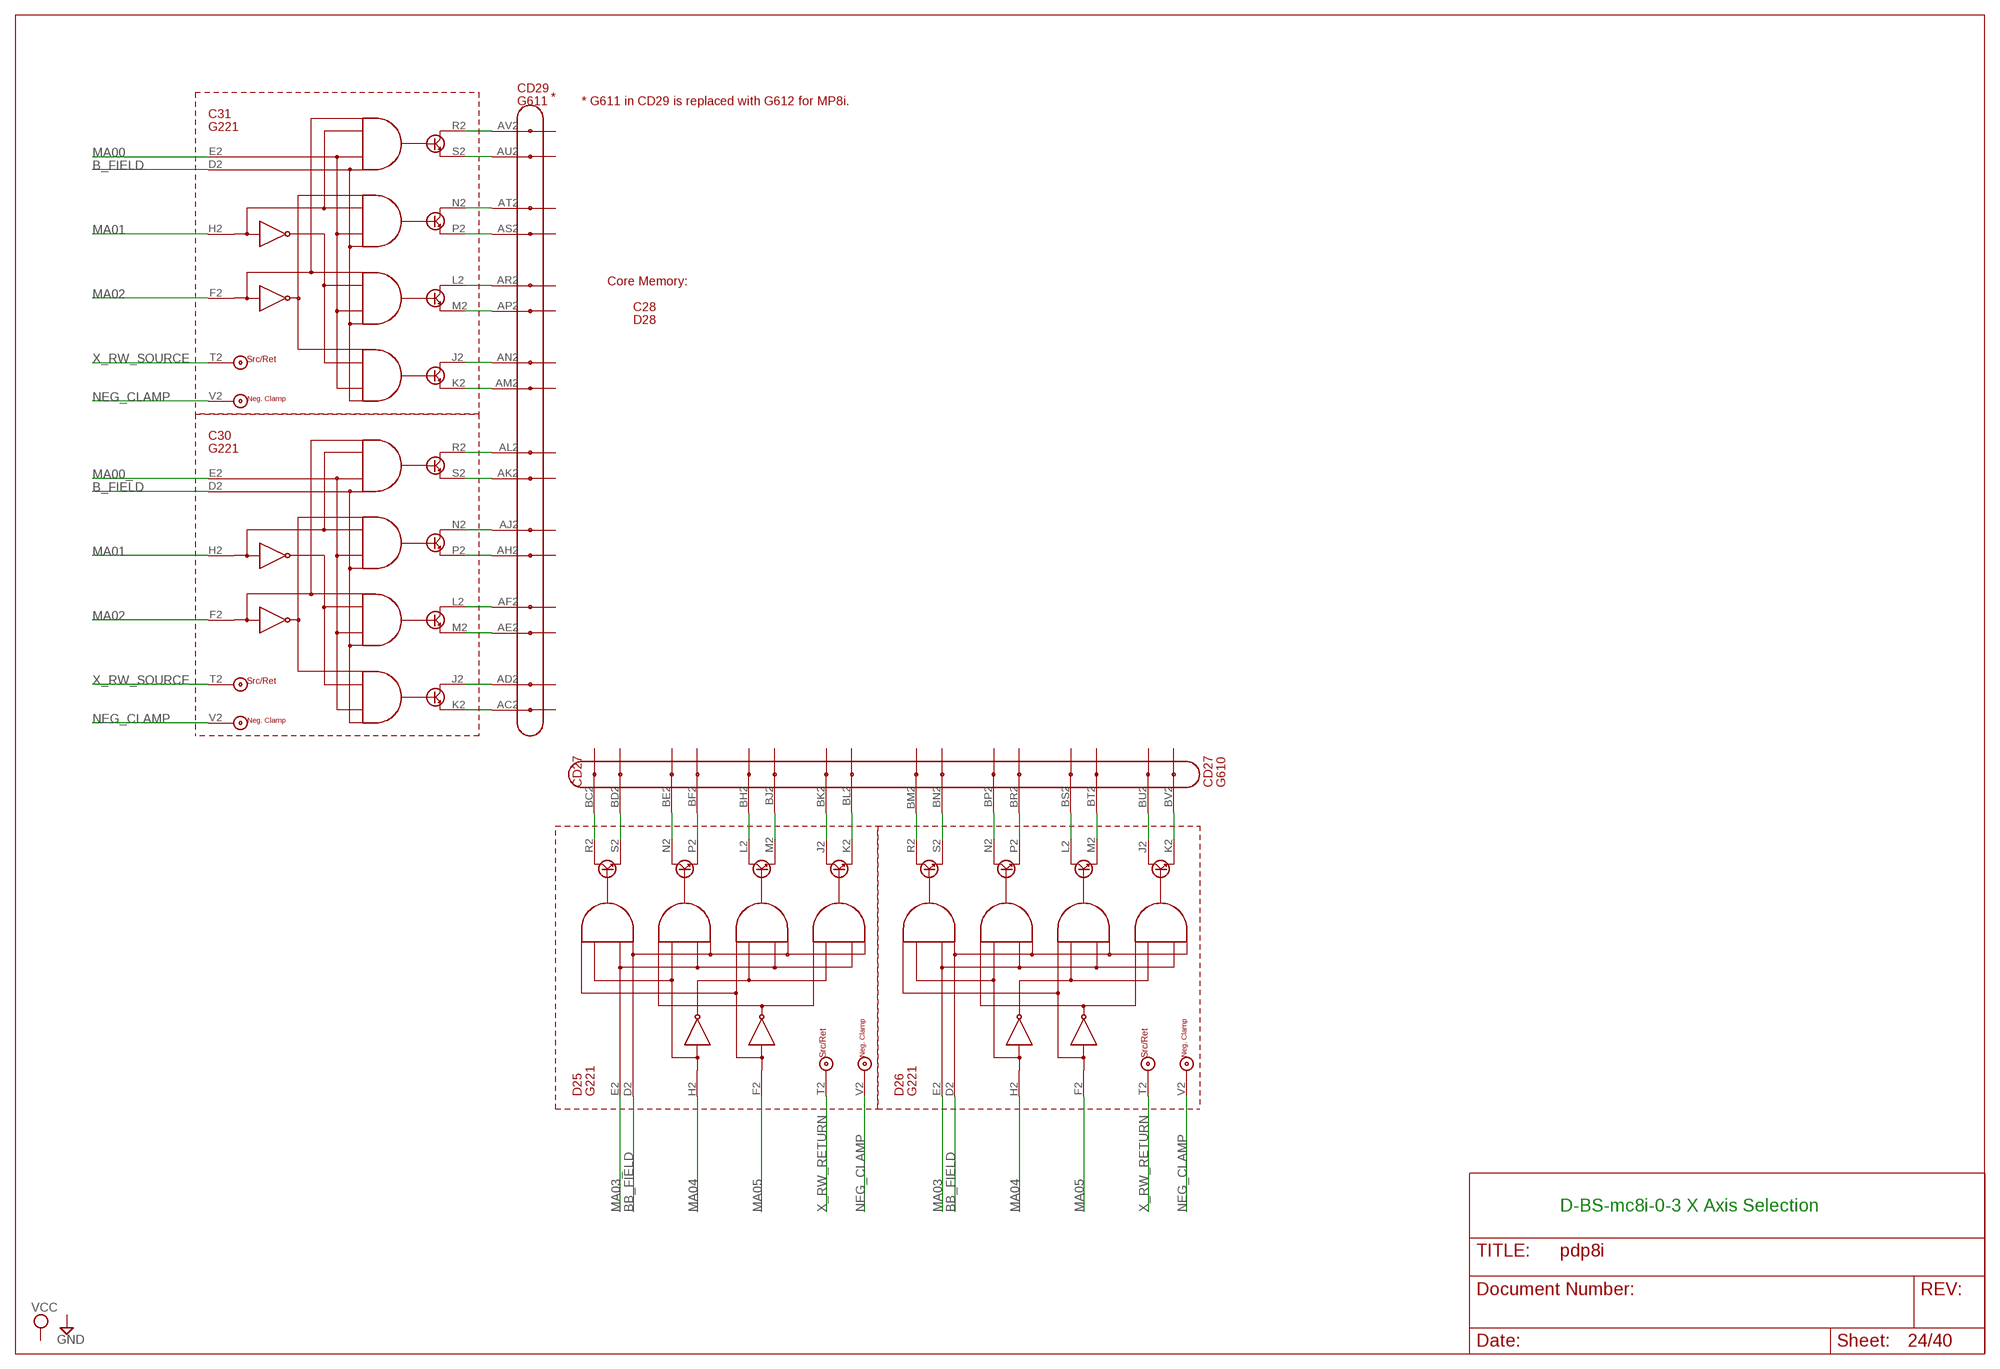
[diagram p24: schematic, sheet 24]

### Parts
C28  H807  [H807]
C30  G221  [H807]
C31  G221  [H807]
CD27  G610  [H807-2]
CD29  G611  G610  [H807-2]
D25  G221  [H807]
D26  G221  [H807]
D28  H807  [H807]

### Nets
B_FIELD: C30.D2 C31.D2 ; also sheet 17,18,23,25
BB_FIELD: D25.D2 D26.D2 ; also sheet 17,25
C23J3: C31.J2 CD29.AN2(N2)
C23K3: C31.K2 CD29.AM2(M2)
C23L3: C31.L2 CD29.AR2(R2)
C23M3: C31.M2 CD29.AP2(P2)
C23N3: C31.N2 CD29.AT2(T2)
C23P3: C31.P2 CD29.AS2(S2)
C23R3: C31.R2 CD29.AV2(V2)
C23S3: C31.S2 CD29.AU2(U2)
C24J3: C30.J2 CD29.AD2(D2)
C24K3: C30.K2 CD29.AC2(C2)
C24M3: C30.M2 CD29.AE2(E2)
C24N3: C30.N2 CD29.AJ2(J2)
C24P3: C30.P2 CD29.AH2(H2)
C24R3: C30.R2 CD29.AL2(L2)
C24S3: C30.S2 CD29.AK2(K2)
D18J3: CD27.BK2(K2) D25.J2
D18K3: CD27.BL2(L2) D25.K2
D18L3: CD27.BH2(H2) D25.L2
D18M3: CD27.BJ2(J2) D25.M2
D18N3: CD27.BE2(E2) D25.N2
D18P3: CD27.BF2(F2) D25.P2
D18R3: CD27.BC2(C2) D25.R2
D18S3: CD27.BD2(D2) D25.S2
D19J3: CD27.BU2(U2) D26.J2
D19K3: CD27.BV2(V2) D26.K2
D19L3: CD27.BS2(S2) D26.L2
D19M3: CD27.BT2(T2) D26.M2
D19N3: CD27.BP2(P2) D26.N2
D19P3: CD27.BR2(R2) D26.P2
D19R3: CD27.BM2(M2) D26.R2
D19S3: CD27.BN2(N2) D26.S2
MA00: C31.E2 ; also sheet 9,19
MA00_: C30.E2 ; also sheet 6,9,19,21
MA01: C30.H2 C31.H2 ; also sheet 9,19
MA02: C30.F2 C31.F2 ; also sheet 9,19
MA03: D26.E2 ; also sheet 9,19
MA03_: D25.E2 ; also sheet 6,9,19,21
MA04: D25.H2 D26.H2 ; also sheet 9,19
MA05: D25.F2 D26.F2 ; also sheet 9,19
NEG_CLAMP: C30.V2 C31.V2 D25.V2 D26.V2 ; also sheet 17,19,20,25
V24L3: C30.L2 CD29.AF2(F2)
X_RW_RETURN: D25.T2 D26.T2 ; also sheet 17,19
X_RW_SOURCE: C30.T2 C31.T2 ; also sheet 17,19

### Notes on the sheet
- *
- * G611 in CD29 is replaced with G612 for MP8i.
- Core Memory:
- CD27
- D-BS-mc8i-0-3 X Axis Selection

## Sheet 25 of 40
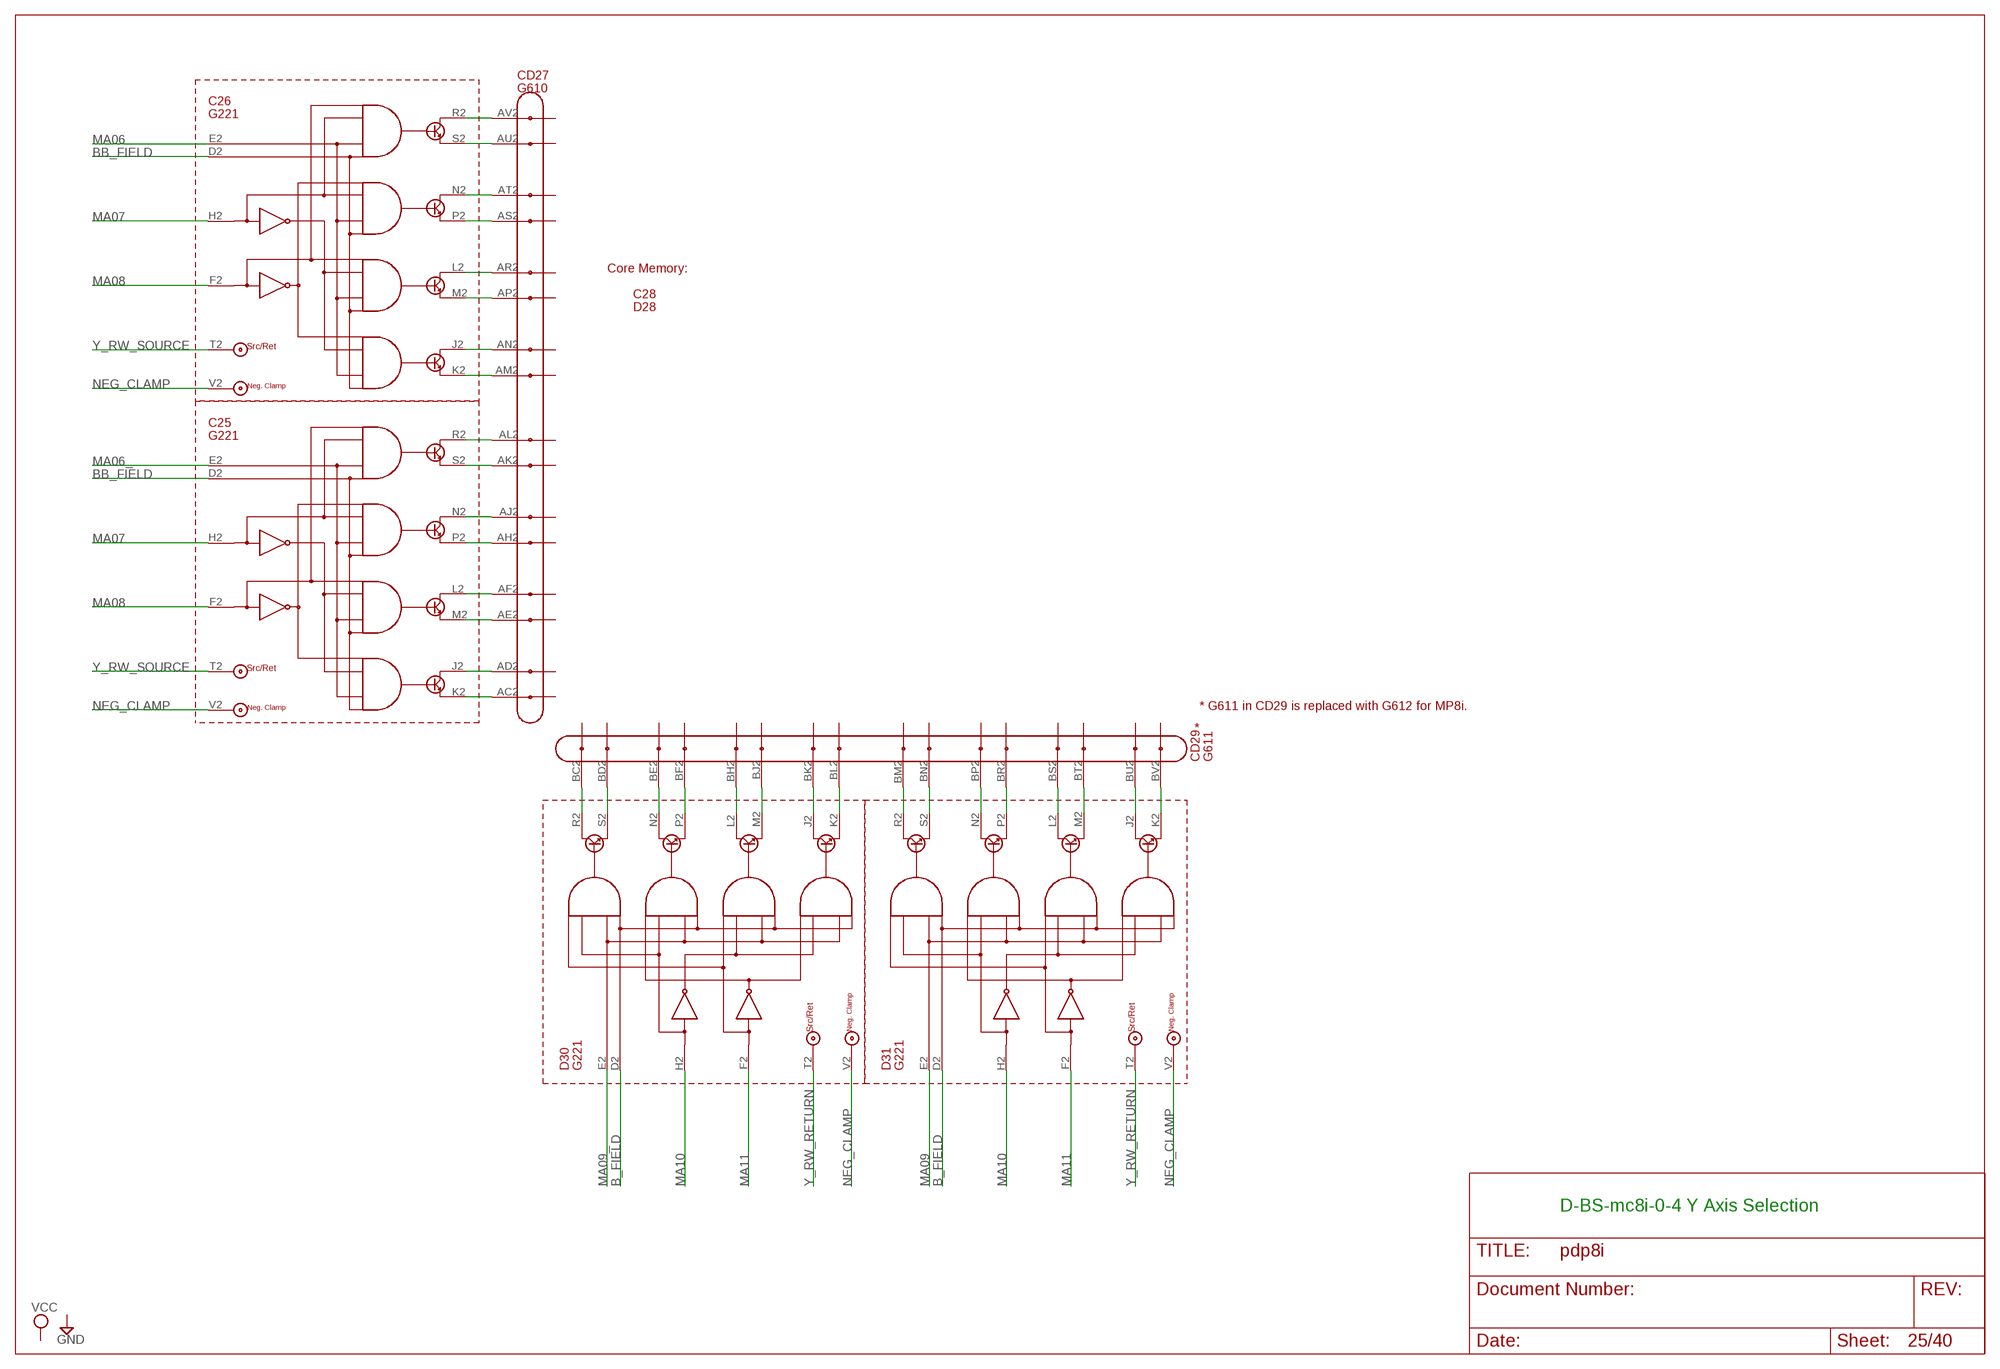
[diagram p25: schematic, sheet 25]

### Parts
C25  G221  [H807]
C26  G221  [H807]
D30  G221  [H807]
D31  G221  [H807]

### Nets
B_FIELD: D30.D2 D31.D2 ; also sheet 17,18,23,24
BB_FIELD: C25.D2 C26.D2 ; also sheet 17,24
C23J4: C26.J2 CD27.AN2(N2)
C23K4: C26.K2 CD27.AM2(M2)
C23L4: C26.L2 CD27.AR2(R2)
C23M4: C26.M2 CD27.AP2(P2)
C23N4: C26.N2 CD27.AT2(T2)
C23P4: C26.P2 CD27.AS2(S2)
C23R4: C26.R2 CD27.AV2(V2)
C23S4: C26.S2 CD27.AU2(U2)
C24J4: C25.J2 CD27.AD2(D2)
C24K4: C25.K2 CD27.AC2(C2)
C24M4: C25.M2 CD27.AE2(E2)
C24N4: C25.N2 CD27.AJ2(J2)
C24P4: C25.P2 CD27.AH2(H2)
C24R4: C25.R2 CD27.AL2(L2)
C24S4: C25.S2 CD27.AK2(K2)
D18J4: CD29.BK2(K2) D30.J2
D18K4: CD29.BL2(L2) D30.K2
D18L4: CD29.BH2(H2) D30.L2
D18M4: CD29.BJ2(J2) D30.M2
D18N4: CD29.BE2(E2) D30.N2
D18P4: CD29.BF2(F2) D30.P2
D18R4: CD29.BC2(C2) D30.R2
D18S4: CD29.BD2(D2) D30.S2
D19J4: CD29.BU2(U2) D31.J2
D19K4: CD29.BV2(V2) D31.K2
D19L4: CD29.BS2(S2) D31.L2
D19M4: CD29.BT2(T2) D31.M2
D19N4: CD29.BP2(P2) D31.N2
D19P4: CD29.BR2(R2) D31.P2
D19R4: CD29.BM2(M2) D31.R2
D19S4: CD29.BN2(N2) D31.S2
MA06: C26.E2 ; also sheet 9,20
MA06_: C25.E2 ; also sheet 6,9,20,21
MA07: C25.H2 C26.H2 ; also sheet 9,20
MA08: C25.F2 C26.F2 ; also sheet 6,9,20
MA09: D31.E2 ; also sheet 9,20
MA09_: D30.E2 ; also sheet 9,20,21
MA10: D30.H2 D31.H2 ; also sheet 9,20
MA11: D30.F2 D31.F2 ; also sheet 9,20
NEG_CLAMP: C25.V2 C26.V2 D30.V2 D31.V2 ; also sheet 17,19,20,24
V24L4: C25.L2 CD27.AF2(F2)
Y_RW_RETURN: D30.T2 D31.T2 ; also sheet 17,20
Y_RW_SOURCE: C25.T2 C26.T2 ; also sheet 17,20

### Notes on the sheet
- Core Memory:
- C28
- D28
- * G611 in CD29 is replaced with G612 for MP8i.
- *
- D-BS-mc8i-0-4 Y Axis Selection

## Sheet 26 of 40
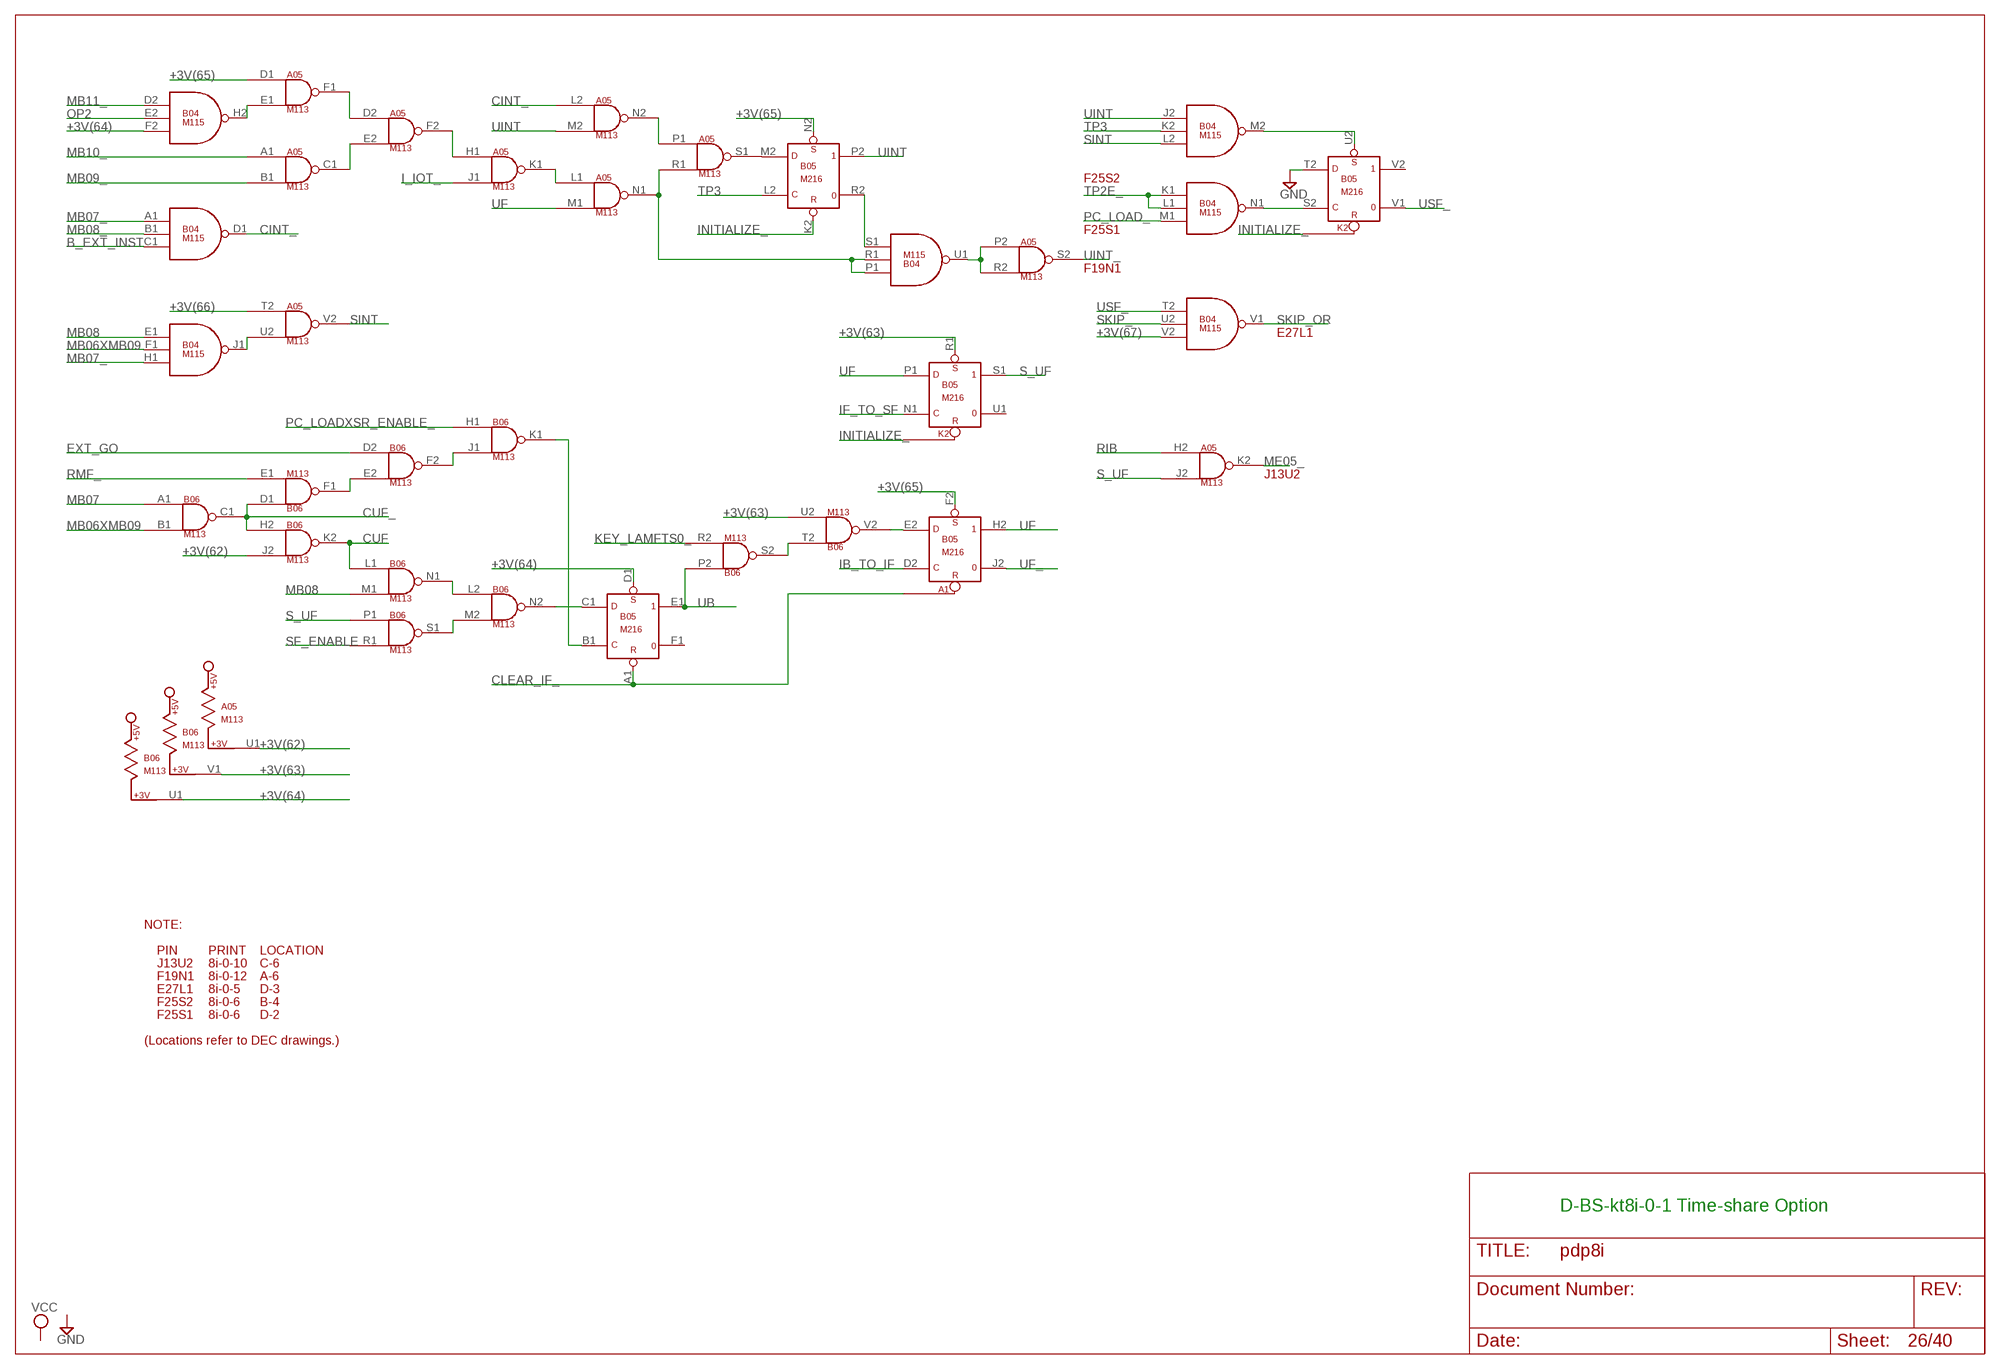
[diagram p26: schematic, sheet 26]

### Parts
A05  M113  [H807]
B04  M115  [H807]
B05  M216  [H807]
B06  M113  [H807]

### Nets
+3V(62): A05.U1 B06.J2(K2:IN2)
+3V(63): B05.R1(S1:S) B06.U2(V2:IN2) B06.V1
+3V(64): B04.F2(H2:IN3) B05.D1(E1:S) B06.U1
+3V(65): A05.D1(F1:IN1) B05.F2(H2:S) B05.N2(P2:S) ; also sheet 4,5
+3V(66): A05.T2(V2:IN1) ; also sheet 22
+3V(67): B04.V2(V1:IN3) ; also sheet 22
B_EXT_INST: B04.C1(D1:IN3) ; also sheet 22
CINT_: A05.L2(N2:IN1) B04.D1(D1:OUT)
CLEAR_IF_: B05.A1(E1:R) ; also sheet 21,22
CUF: B06.K2(K2:OUT) B06.L1(N1:IN1)
CUF_: B06.C1(C1:OUT) B06.D1(F1:IN1) B06.H2(K2:IN1) ; also sheet 22
EXT_GO: B06.D2(F2:IN1) ; also sheet 22
GND [Suppply]: B05.T2(V2:D) ; also sheet 2,5,9,10,11,12,13,14,15,17,18,23,27,30,33,34,35,39
I_IOT_: A05.J1(K1:IN2) ; also sheet 4
IB_TO_IF: B05.D2(H2:C) ; also sheet 22
IF_TO_SF: B05.N1(S1:C) ; also sheet 21
INITIALIZE_: B05.K2(P2:R) ; also sheet 2,14,30,32,35,36,37,38,39
KEY_LAMFTS0_: B06.R2(S2:IN2) ; also sheet 5,22
MB06XMB09: B04.F1(J1:IN2) B06.B1(C1:IN2) ; also sheet 22
MB07: B06.A1(C1:IN1) ; also sheet 5,7,9,14,15,21,22,27,30,33,34,35,37,38
MB07_: B04.A1(D1:IN1) B04.H1(J1:IN3) ; also sheet 5,8,9,14,16,18,22,23,28,29,30,32,33,34,36
MB08: B04.E1(J1:IN1) B06.M1(N1:IN2) ; also sheet 6,7,9,14,15,21,22,27,30,33,34,36,37,38
MB08_: B04.B1(D1:IN2) ; also sheet 6,7,8,9,14,16,18,22,23,28,29,30,32,33,34,35
MB09_: A05.B1(C1:IN2) ; also sheet 6,9,18,23,27,28,30,33,37
MB10_: A05.A1(C1:IN1) ; also sheet 6,8,9,18,22,23,27,28,30,37
MB11_: B04.D2(H2:IN1) ; also sheet 2,5,7,8,9,18,22,23,28,29,30
ME05_: A05.K2(K2:OUT) ; also sheet 14
N$548: A05.E1(F1:IN2) B04.H2(H2:OUT)
N$549: A05.D2(F2:IN1) A05.F1(F1:OUT)
N$550: A05.C1(C1:OUT) A05.E2(F2:IN2)
N$551: A05.F2(F2:OUT) A05.H1(K1:IN1)
N$552: A05.U2(V2:IN2) B04.J1(J1:OUT)
N$553: B06.E2(F2:IN2) B06.F1(F1:OUT)
N$554: B06.L2(N2:IN1) B06.N1(N1:OUT)
N$555: B06.M2(N2:IN2) B06.S1(S1:OUT)
N$556: B05.C1(E1:D) B06.N2(N2:OUT)
N$557: B06.F2(F2:OUT) B06.J1(K1:IN2)
N$558: B05.B1(E1:C) B06.K1(K1:OUT)
N$559: B06.S2(S2:OUT) B06.T2(V2:IN1)
N$560: B05.E2(H2:D) B06.V2(V2:OUT)
N$561: A05.K1(K1:OUT) A05.L1(N1:IN1)
N$562: A05.N2(N2:OUT) A05.P1(S1:IN1)
N$563: A05.N1(N1:OUT) A05.R1(S1:IN2) B04.P1(U1:IN1) B04.R1(U1:IN2)
N$564: A05.S1(S1:OUT) B05.M2(P2:D)
N$565: B04.S1(U1:IN3) B05.R2
N$566: A05.P2(S2:IN1) A05.R2(S2:IN2) B04.U1(U1:OUT)
N$567: B04.M2(M2:OUT) B05.U2(V2:S)
N$569: B04.N1(N1:OUT) B05.S2(V2:C)
OP2: B04.E2(H2:IN2) ; also sheet 2,5,7,27
PC_LOAD_: B04.M1(N1:IN3) ; also sheet 7
PC_LOADXSR_ENABLE_: B06.H1(K1:IN1) ; also sheet 22
RIB: A05.H2(K2:IN1) ; also sheet 22
RMF_: B06.E1(F1:IN2) ; also sheet 22
S_UF: A05.J2(K2:IN2) B05.S1 B06.P1(S1:IN1)
SF_ENABLE: B06.R1(S1:IN2) ; also sheet 22
SINT: A05.V2(V2:OUT) B04.L2(M2:IN3)
SKIP_: B04.U2(V1:IN2) ; also sheet 7
SKIP_OR: B04.V1(V1:OUT) ; also sheet 6
TP2E_: B04.K1(N1:IN1) B04.L1(N1:IN2) ; also sheet 7
TP3: B04.K2(M2:IN2) B05.L2(P2:C) ; also sheet 2,7,21,22,27,29,30
UB: B05.E1 B06.P2(S2:IN1)
UF: A05.M1(N1:IN2) B05.H2 B05.P1(S1:D)
UF_: B05.J2 ; also sheet 2,4,5
UINT: A05.M2(N2:IN2) B04.J2(M2:IN1) B05.P2
UINT_: A05.S2(S2:OUT) ; also sheet 16
USF_: B04.T2(V1:IN1) B05.V1
Unconnected: A05.V1 B04.N2(S2:IN1) B04.P2(S2:IN2) B04.R2(S2:IN3) B04.S2(S2:OUT) B05.F1 B05.H1(L1:C) B05.J1(L1:D) B05.K1(L1:S) B05.L1 B05.M1 B05.U1 B05.V2

### Notes on the sheet
- F25S2
- F25S1
- F19N1
- E27L1
- J13U2
- NOTE:
- PIN | PRINT | LOCATION
- J13U2 | 8i-0-10 | C-6
- F19N1 | 8i-0-12 | A-6
- E27L1 | 8i-0-5 | D-3
- F25S2 | 8i-0-6 | B-4
- F25S1 | 8i-0-6 | D-2
- (Locations refer to DEC drawings.)
- D-BS-kt8i-0-1 Time-share Option

## Sheet 27 of 40
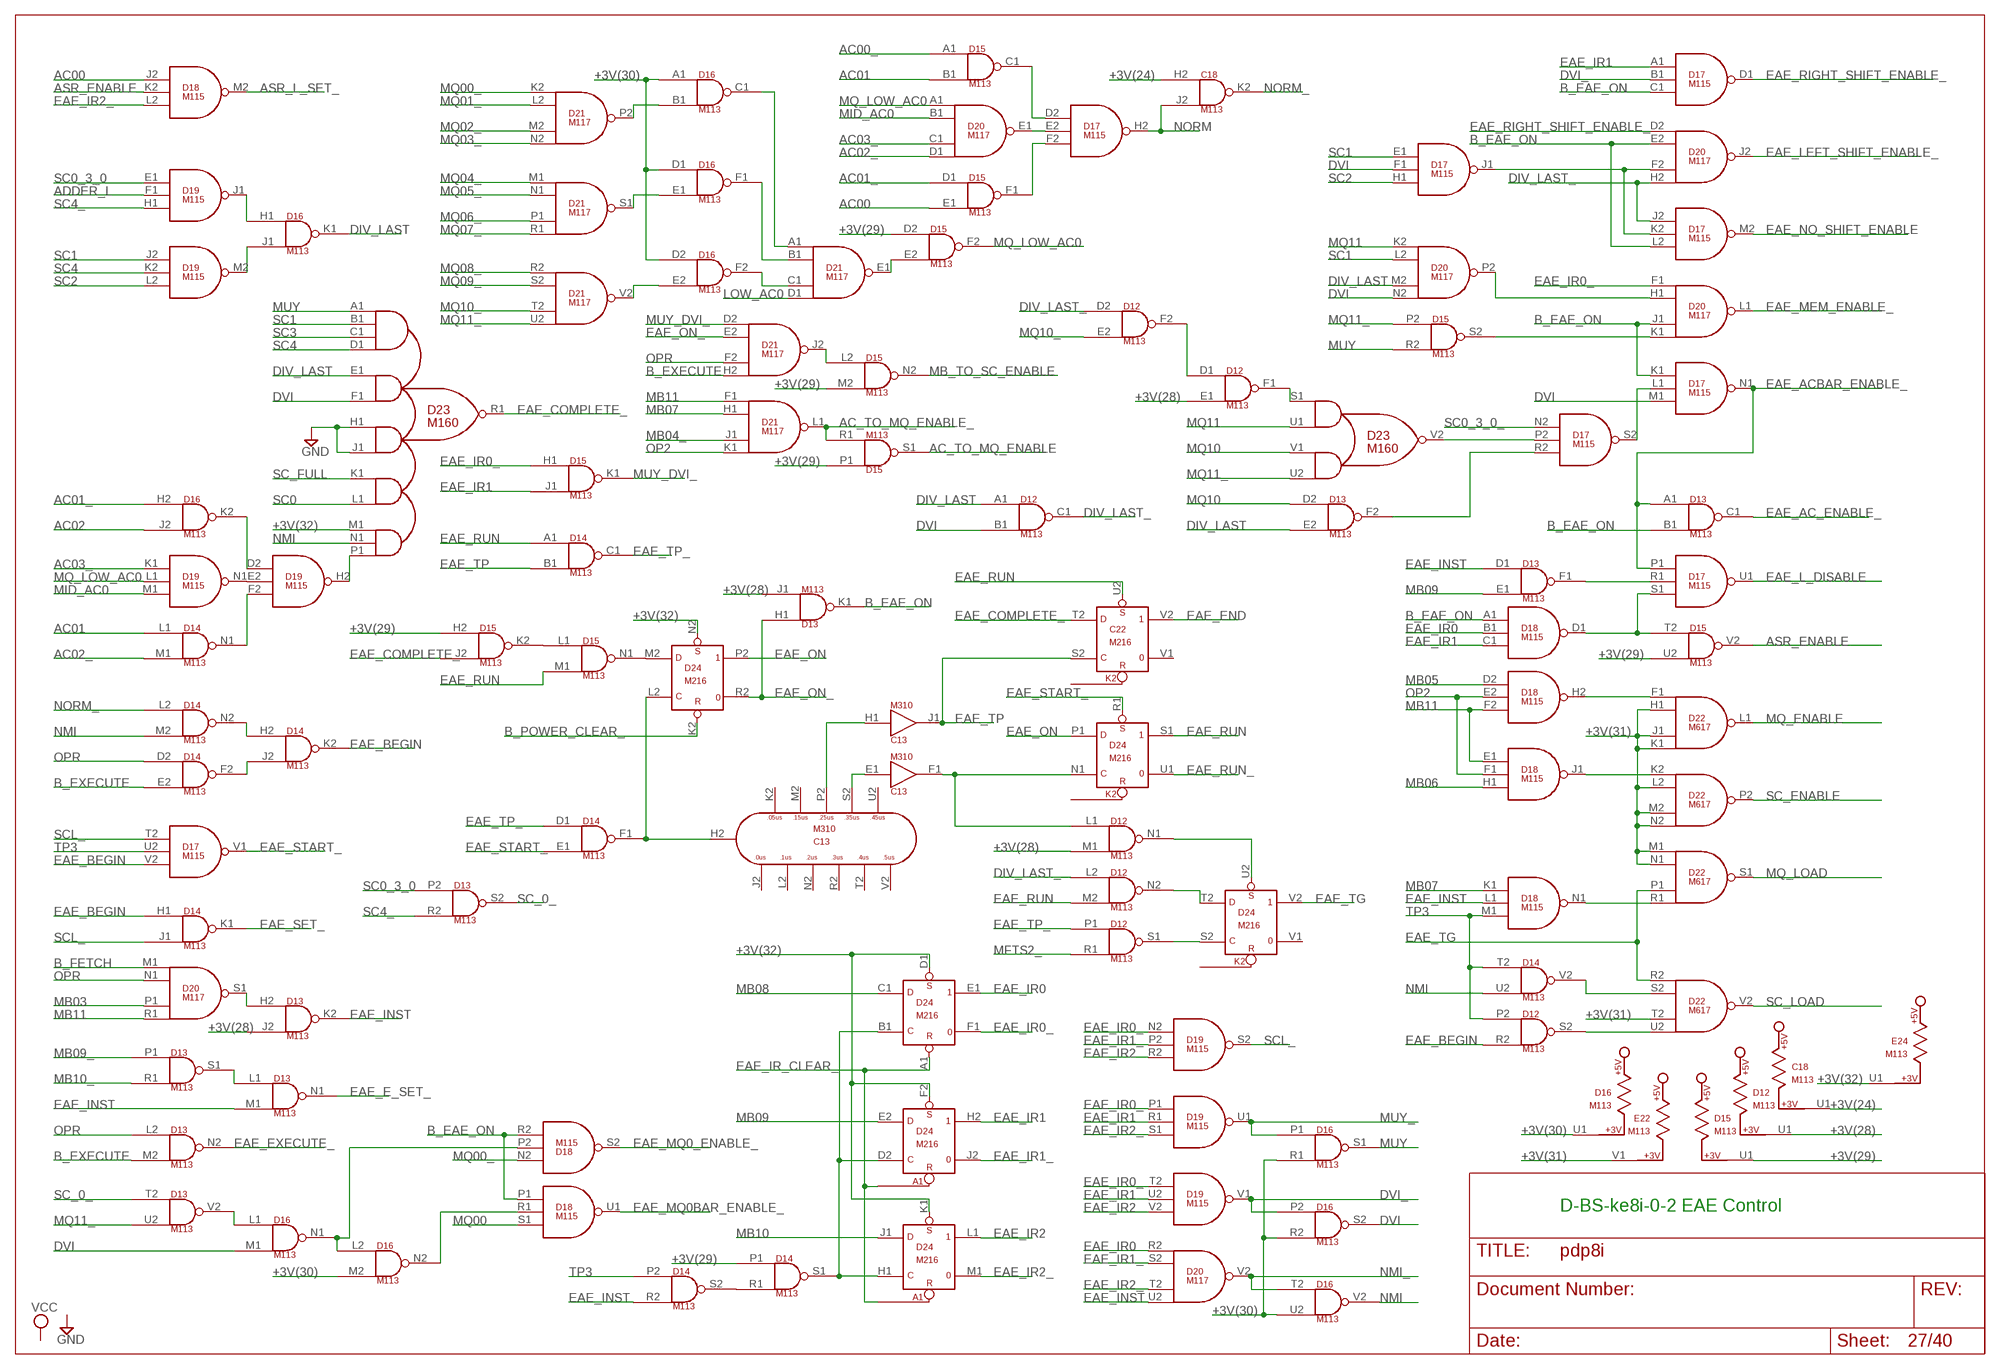
[diagram p27: schematic, sheet 27]

### Parts
C13  M310  [H807]
C18  M113  [H807]
C22  M216  [H807]
D12  M113  [H807]
D13  M113  [H807]
D14  M113  [H807]
D15  M113  [H807]
D16  M113  [H807]
D17  M115  [H807]
D18  M115  [H807]
D19  M115  [H807]
D20  M117  [H807]
D21  M117  [H807]
D22  M617  [H807]
D23  M160  [H807]
D24  M216  [H807]

### Nets
+3V(24): C18.H2(K2:IN1) C18.U1 ; also sheet 28
+3V(28): D12.E1(F1:IN2) D12.M1(N1:IN2) D12.U1 D13.J1(K1:IN2) D13.J2(K2:IN2) ; also sheet 28
+3V(29): D14.P1(S1:IN1) D15.D2(F2:IN1) D15.H2(K2:IN1) D15.M2(N2:IN2) D15.P1(S1:IN1) D15.U1 D15.U2(V2:IN2)
+3V(30): D16.A1(C1:IN1) D16.D1(F1:IN1) D16.D2(F2:IN1) D16.M2(N2:IN2) D16.R1(S1:IN2) D16.R2(S2:IN2) D16.U1 D16.U2(V2:IN2)
+3V(31): D22.H1(L1:IN2) D22.J1(L1:IN3) D22.K1(L1:IN4) D22.L2(P2:IN2) D22.M1(S1:IN1) D22.M2(P2:IN3) D22.N1(S1:IN2) D22.N2(P2:IN4) D22.T2(V2:IN3) E22.V1
+3V(32): D23.M1(R1:IN5A) D24.D1(E1:S) D24.F2(H2:S) D24.K1(L1:S) D24.N2(P2:S) E24.U1 ; also sheet 28
AC00: D15.E1(F1:IN2) D18.J2(M2:IN1) ; also sheet 7,9,14,28,37
AC00_: D15.A1(C1:IN1) ; also sheet 7,9
AC01: D14.L1(N1:IN1) D15.B1(C1:IN2) ; also sheet 9,14,28,37
AC01_: D15.D1(F1:IN1) D16.H2(K2:IN1) ; also sheet 7,9
AC02: D16.J2(K2:IN2) ; also sheet 9,14,28,33,37
AC02_: D14.M1(N1:IN2) D20.D1(E1:IN4) ; also sheet 7,9
AC03_: D19.K1(N1:IN1) D20.C1(E1:IN3) ; also sheet 7,9
AC_TO_MQ_ENABLE: D15.S1(S1:OUT) ; also sheet 28
AC_TO_MQ_ENABLE_: D15.R1(S1:IN2) D21.L1(L1:OUT) ; also sheet 5
ADDER_L: D19.F1(J1:IN2) ; also sheet 28
ASR_ENABLE: D15.V2(V2:OUT) D18.K2(M2:IN2) ; also sheet 9
ASR_L_SET_: D18.M2(M2:OUT) ; also sheet 9
B_EAE_ON: D13.B1(C1:IN2) D13.K1(K1:OUT) D17.C1(D1:IN3) D17.K1(N1:IN1) D17.L2(M2:IN3) D18.A1(D1:IN1) D18.P1(U1:IN1) D18.R2(S2:IN3) D20.E2(J2:IN2) D20.J1(L1:IN3) ; also sheet 9,28
B_EXECUTE: D13.M2(N2:IN2) D14.E2(F2:IN2) D21.H2(J2:IN4) ; also sheet 4,5,6,7
B_FETCH: D20.M1(S1:IN1) ; also sheet 2,4,5,6,7,8,22,29
B_POWER_CLEAR_: D24.K2(P2:R) ; also sheet 2,17
DIV_LAST: D12.A1(C1:IN1) D13.E2(F2:IN2) D16.K1(K1:OUT) D20.M2(P2:IN3) D23.E1(R1:IN2A)
DIV_LAST_: D12.C1(C1:OUT) D12.D2(F2:IN1) D12.L2(N2:IN1) D17.J2(M2:IN1) D20.H2(J2:IN4)
DVI: D12.B1(C1:IN2) D16.M1(N1:IN2) D16.S2(S2:OUT) D17.F1(J1:IN2) D17.M1(N1:IN3) D20.N2(P2:IN4) D23.F1(R1:IN2B)
DVI_: D16.P2(S2:IN1) D17.B1(D1:IN2) D19.V1(V1:OUT) ; also sheet 28
EAE_AC_ENABLE_: D13.C1(C1:OUT) ; also sheet 5
EAE_ACBAR_ENABLE_: D13.A1(C1:IN1) D17.N1(N1:OUT) D17.P1(U1:IN1) ; also sheet 5
EAE_BEGIN: D12.R2(S2:IN2) D14.H1(K1:IN1) D14.K2(K2:OUT) D17.V2(V1:IN3)
EAE_COMPLETE_: C22.T2(V2:D) D15.J2(K2:IN2) D23.R1(R1:OUT)
EAE_E_SET_: D13.N1(N1:OUT) ; also sheet 4,5
EAE_END: C22.V2 ; also sheet 2
EAE_EXECUTE_: D13.N2(N2:OUT) ; also sheet 6
EAE_INST: D13.D1(F1:IN1) D13.K2(K2:OUT) D13.M1(N1:IN2) D14.R2(S2:IN2) D18.L1(N1:IN2) D20.U2(V2:IN4)
EAE_IR0: D18.B1(D1:IN2) D20.R2(V2:IN1) D24.E1
EAE_IR0_: D15.H1(K1:IN1) D19.N2(S2:IN1) D19.P1(U1:IN1) D19.T2(V1:IN1) D20.F1(L1:IN1) D24.F1
EAE_IR1: D15.J1(K1:IN2) D17.A1(D1:IN1) D18.C1(D1:IN3) D19.R1(U1:IN2) D19.U2(V1:IN2) D24.H2
EAE_IR1_: D19.P2(S2:IN2) D20.S2(V2:IN2) D24.J2
EAE_IR2: D19.R2(S2:IN3) D19.V2(V1:IN3) D24.L1
EAE_IR2_: D18.L2(M2:IN3) D19.S1(U1:IN3) D20.T2(V2:IN3) D24.M1 ; also sheet 9
EAE_IR_CLEAR_: D24.A1(E1:R) ; also sheet 4
EAE_L_DISABLE: D17.U1(U1:OUT) ; also sheet 5
EAE_LEFT_SHIFT_ENABLE_: D20.J2(J2:OUT) ; also sheet 6
EAE_MEM_ENABLE_: D20.L1(L1:OUT) ; also sheet 5
EAE_MQ0_ENABLE_: D18.S2(S2:OUT) ; also sheet 13
EAE_MQ0BAR_ENABLE_: D18.U1(U1:OUT) ; also sheet 13
EAE_NO_SHIFT_ENABLE: D17.M2(M2:OUT) ; also sheet 6
EAE_ON: D24.P1(S1:D) D24.P2 ; also sheet 28
EAE_ON_: D13.H1(K1:IN1) D21.E2(J2:IN2) D24.R2 ; also sheet 9,13
EAE_RIGHT_SHIFT_ENABLE_: D17.D1(D1:OUT) D20.D2(J2:IN1) ; also sheet 6,28
EAE_RUN: C22.U2(V2:S) D12.M2(N2:IN2) D14.A1(C1:IN1) D15.M1(N1:IN2) D24.S1
EAE_RUN_: D24.U1
EAE_SET_: D14.K1(K1:OUT) ; also sheet 2
EAE_START_: D14.E1(F1:IN2) D17.V1(V1:OUT) D24.R1(S1:S) ; also sheet 2
EAE_TG: D22.P1(S1:IN3) D22.R2(V2:IN1) D24.V2
EAE_TP: C13.J1(J1:OUT) C22.S2(V2:C) D14.B1(C1:IN2)
EAE_TP_: D12.P1(S1:IN1) D14.C1(C1:OUT) D14.D1(F1:IN1) ; also sheet 7,28
GND [Suppply]: D23.H1(R1:IN3A) D23.J1(R1:IN3B) ; also sheet 2,5,9,10,11,12,13,14,15,17,18,23,26,30,33,34,35,39
LOW_AC0: D21.D1(E1:IN4) ; also sheet 7
MB03: D20.P1(S1:IN3) ; also sheet 4,5,9,14,21,29,30,34,38
MB04_: D21.J1(L1:IN3) ; also sheet 5,8,9,14,15,16,18,23,29,30,32,33,34,35,36,37
MB05: D18.D2(H2:IN1) ; also sheet 5,7,9,14,21,30,32,34,37
MB06: D18.H1(J1:IN3) ; also sheet 5,7,9,14,16,21,22,30,33,38
MB07: D18.K1(N1:IN1) D21.H1(L1:IN2) ; also sheet 5,7,9,14,15,21,22,26,30,33,34,35,37,38
MB08: D24.C1(E1:D) ; also sheet 6,7,9,14,15,21,22,26,30,33,34,36,37,38
MB09: D13.E1(F1:IN2) D24.E2(H2:D) ; also sheet 2,5,6,9,14,21,22,29,30,37
MB09_: D13.P1(S1:IN1) ; also sheet 6,9,18,23,26,28,30,33,37
MB10: D24.J1(L1:D) ; also sheet 2,6,8,9,14,21,22,29,30,33,37
MB10_: D13.R1(S1:IN2) ; also sheet 6,8,9,18,22,23,26,28,30,37
MB11: D18.E1(J1:IN1) D18.F2(H2:IN3) D20.R1(S1:IN4) D21.F1(L1:IN1) ; also sheet 2,6,9,14,21,22,29,30,33,37
MB_TO_SC_ENABLE: D15.N2(N2:OUT) ; also sheet 28
MFTS2_: D12.R1(S1:IN2) ; also sheet 2
MID_AC0: D19.M1(N1:IN3) D20.B1(E1:IN2) ; also sheet 7
MQ00: D18.S1(U1:IN3) ; also sheet 10,28
MQ00_: D18.N2(S2:IN1) D21.K2(P2:IN1) ; also sheet 28
MQ01_: D21.L2(P2:IN2) ; also sheet 28
MQ02_: D21.M2(P2:IN3) ; also sheet 28
MQ03_: D21.N2(P2:IN4) ; also sheet 28
MQ04_: D21.M1(S1:IN1) ; also sheet 28
MQ05_: D21.N1(S1:IN2) ; also sheet 28
MQ06_: D21.P1(S1:IN3) ; also sheet 28
MQ07_: D21.R1(S1:IN4) ; also sheet 28
MQ08_: D21.R2(V2:IN1) ; also sheet 28
MQ09_: D21.S2(V2:IN2) ; also sheet 28
MQ10: D13.D2(F2:IN1) D23.V1(V2:IN2A) ; also sheet 13,28
MQ10_: D12.E2(F2:IN2) D21.T2(V2:IN3) ; also sheet 28
MQ11: D20.K2(P2:IN1) D23.U1(V2:IN1B) ; also sheet 13,28
MQ11_: D13.U2(V2:IN2) D15.P2(S2:IN1) D21.U2(V2:IN4) D23.U2(V2:IN2B) ; also sheet 28
MQ_ENABLE: D22.L1(L1:OUT) ; also sheet 10,11,12,13
MQ_LOAD: D22.S1(S1:OUT) ; also sheet 28
MQ_LOW_AC0: D15.F2(F2:OUT) D19.L1(N1:IN2) D20.A1(E1:IN1)
MUY: D15.R2(S2:IN2) D16.S1(S1:OUT) D23.A1(R1:IN1A)
MUY_: D16.P1(S1:IN1) D19.U1(U1:OUT)
MUY_DVI_: D15.K1(K1:OUT) D21.D2(J2:IN1)
N$404: D16.H1(K1:IN1) D19.J1(J1:OUT)
N$405: D16.J1(K1:IN2) D19.M2(M2:OUT)
N$406: D19.E2(H2:IN2) D19.N1(N1:OUT)
N$419: D16.K2(K2:OUT) D19.D2(H2:IN1)
N$568: D14.N1(N1:OUT) D19.F2(H2:IN3)
N$570: D19.H2(H2:OUT) D23.P1(R1:IN5C)
N$571: D16.B1(C1:IN2) D21.P2(P2:OUT)
N$572: D16.E1(F1:IN2) D21.S1(S1:OUT)
N$573: D16.E2(F2:IN2) D21.V2(V2:OUT)
N$574: D16.C1(C1:OUT) D21.A1(E1:IN1)
N$575: D16.F2(F2:OUT) D21.C1(E1:IN3)
N$576: D16.F1(F1:OUT) D21.B1(E1:IN2)
N$577: D15.E2(F2:IN2) D21.E1(E1:OUT)
N$578: D17.E2(H2:IN2) D20.E1(E1:OUT)
N$579: D15.C1(C1:OUT) D17.D2(H2:IN1)
N$580: D15.F1(F1:OUT) D17.F2(H2:IN3)
N$581: D15.L2(N2:IN1) D21.J2(J2:OUT)
N$582: D17.J1(J1:OUT) D17.K2(M2:IN2) D20.F2(J2:IN3)
N$583: D17.L1(N1:IN2) D17.S2(S2:OUT)
N$584: D15.S2(S2:OUT) D20.K1(L1:IN4)
N$585: D17.P2(S2:IN2) D23.V2(V2:OUT)
N$586: D20.H1(L1:IN2) D20.P2(P2:OUT)
N$587: D12.D1(F1:IN1) D12.F2(F2:OUT)
N$588: D13.F2(F2:OUT) D17.R2(S2:IN3)
N$589: D12.F1(F1:OUT) D23.S1(V2:IN1A)
N$590: D15.K2(K2:OUT) D15.L1(N1:IN1)
N$591: D13.F1(F1:OUT) D17.R1(U1:IN2)
N$592: D15.T2(V2:IN1) D17.S1(U1:IN3) D18.D1(D1:OUT)
N$593: D18.H2(H2:OUT) D22.F1(L1:IN1)
N$594: D18.N1(N1:OUT) D22.R1(S1:IN4)
N$595: D12.S2(S2:OUT) D22.U2(V2:IN4)
N$596: C13.E1(F1:IN) C13.S2(H2:S2)
N$597: C13.H1(J1:IN) C13.P2(H2:P2)
N$598: D18.J1(J1:OUT) D22.K2(P2:IN1)
N$599: D14.V2(V2:OUT) D22.S2(V2:IN2)
N$600: D14.S1(S1:OUT) D24.B1(E1:C) D24.D2(H2:C) D24.H1(L1:C)
N$601: D14.R1(S1:IN2) D14.S2(S2:OUT)
N$602: D14.F2(F2:OUT) D14.J2(K2:IN2)
N$603: D12.N2(N2:OUT) D24.T2(V2:D)
N$604: D12.N1(N1:OUT) D24.U2(V2:S)
N$605: D12.S1(S1:OUT) D24.S2(V2:C)
N$606: D14.H2(K2:IN1) D14.N2(N2:OUT)
N$607: C13.H2(H2:H2) D14.F1(F1:OUT) D24.L2(P2:C)
N$608: C13.F1(F1:OUT) D12.L1(N1:IN1) D24.N1(S1:C)
N$609: D15.N1(N1:OUT) D24.M2(P2:D)
N$683: D13.H2(K2:IN1) D20.S1(S1:OUT)
N$684: D13.L1(N1:IN1) D13.S1(S1:OUT)
N$685: D13.V2(V2:OUT) D16.L1(N1:IN1)
N$686: D16.L2(N2:IN1) D16.N1(N1:OUT) D18.P2(S2:IN2)
N$688: D16.N2(N2:OUT) D18.R1(U1:IN2)
NMI: D14.M2(N2:IN2) D14.U2(V2:IN2) D16.V2(V2:OUT) D23.N1(R1:IN5B)
NMI_: D16.T2(V2:IN1) D20.V2(V2:OUT)
NORM: C18.J2(K2:IN2) D17.H2(H2:OUT)
NORM_: C18.K2(K2:OUT) D14.L2(N2:IN1)
OP2: D18.E2(H2:IN2) D18.F1(J1:IN2) D21.K1(L1:IN4) ; also sheet 2,5,7,26
OPR: D13.L2(N2:IN1) D14.D2(F2:IN1) D20.N1(S1:IN2) D21.F2(J2:IN3) ; also sheet 4,5,6,7
SC0: D23.L1(R1:IN4B) ; also sheet 12,28
SC0_3_0: D13.P2(S2:IN1) D19.E1(J1:IN1) ; also sheet 28
SC0_3_0_: D17.N2(S2:IN1) ; also sheet 28
SC1: D17.E1(J1:IN1) D19.J2(M2:IN1) D20.L2(P2:IN2) D23.B1(R1:IN1B) ; also sheet 12,28
SC2: D17.H1(J1:IN3) D19.L2(M2:IN3) ; also sheet 13,28
SC3: D23.C1(R1:IN1C) ; also sheet 13,28
SC4: D19.K2(M2:IN2) D23.D1(R1:IN1D) ; also sheet 13,28
SC4_: D13.R2(S2:IN2) D19.H1(J1:IN3) ; also sheet 28
SC_0_: D13.S2(S2:OUT) D13.T2(V2:IN1)
SC_ENABLE: D22.P2(P2:OUT) ; also sheet 10,11,12,13
SC_FULL: D23.K1(R1:IN4A) ; also sheet 28
SC_LOAD: D22.V2(V2:OUT) ; also sheet 28
SCL_: D14.J1(K1:IN2) D17.T2(V1:IN1) D19.S2(S2:OUT)
TP3: D12.P2(S2:IN1) D14.P2(S2:IN1) D14.T2(V2:IN1) D17.U2(V1:IN2) D18.M1(N1:IN3) ; also sheet 2,7,21,22,26,29,30
Unconnected: C13.J2(H2:J2) C13.K2(H2:K2) C13.L2(H2:L2) C13.M2(H2:M2) C13.N2(H2:N2) C13.R2(H2:R2) C13.T2(H2:T2) C13.U2(H2:U2) C13.V2(H2:V2) C18.V1 C22.V1 D12.V1 D13.U1 D13.V1 D14.U1 D14.V1 D15.V1 D16.V1 D18.T2(V1:IN1) D18.U2(V1:IN2) D18.V1(V1:OUT) D18.V2(V1:IN3) D20.U1 D20.V1 D21.U1 D21.V1 D24.V1

### Notes on the sheet
- D-BS-ke8i-0-2 EAE Control

## Sheet 28 of 40
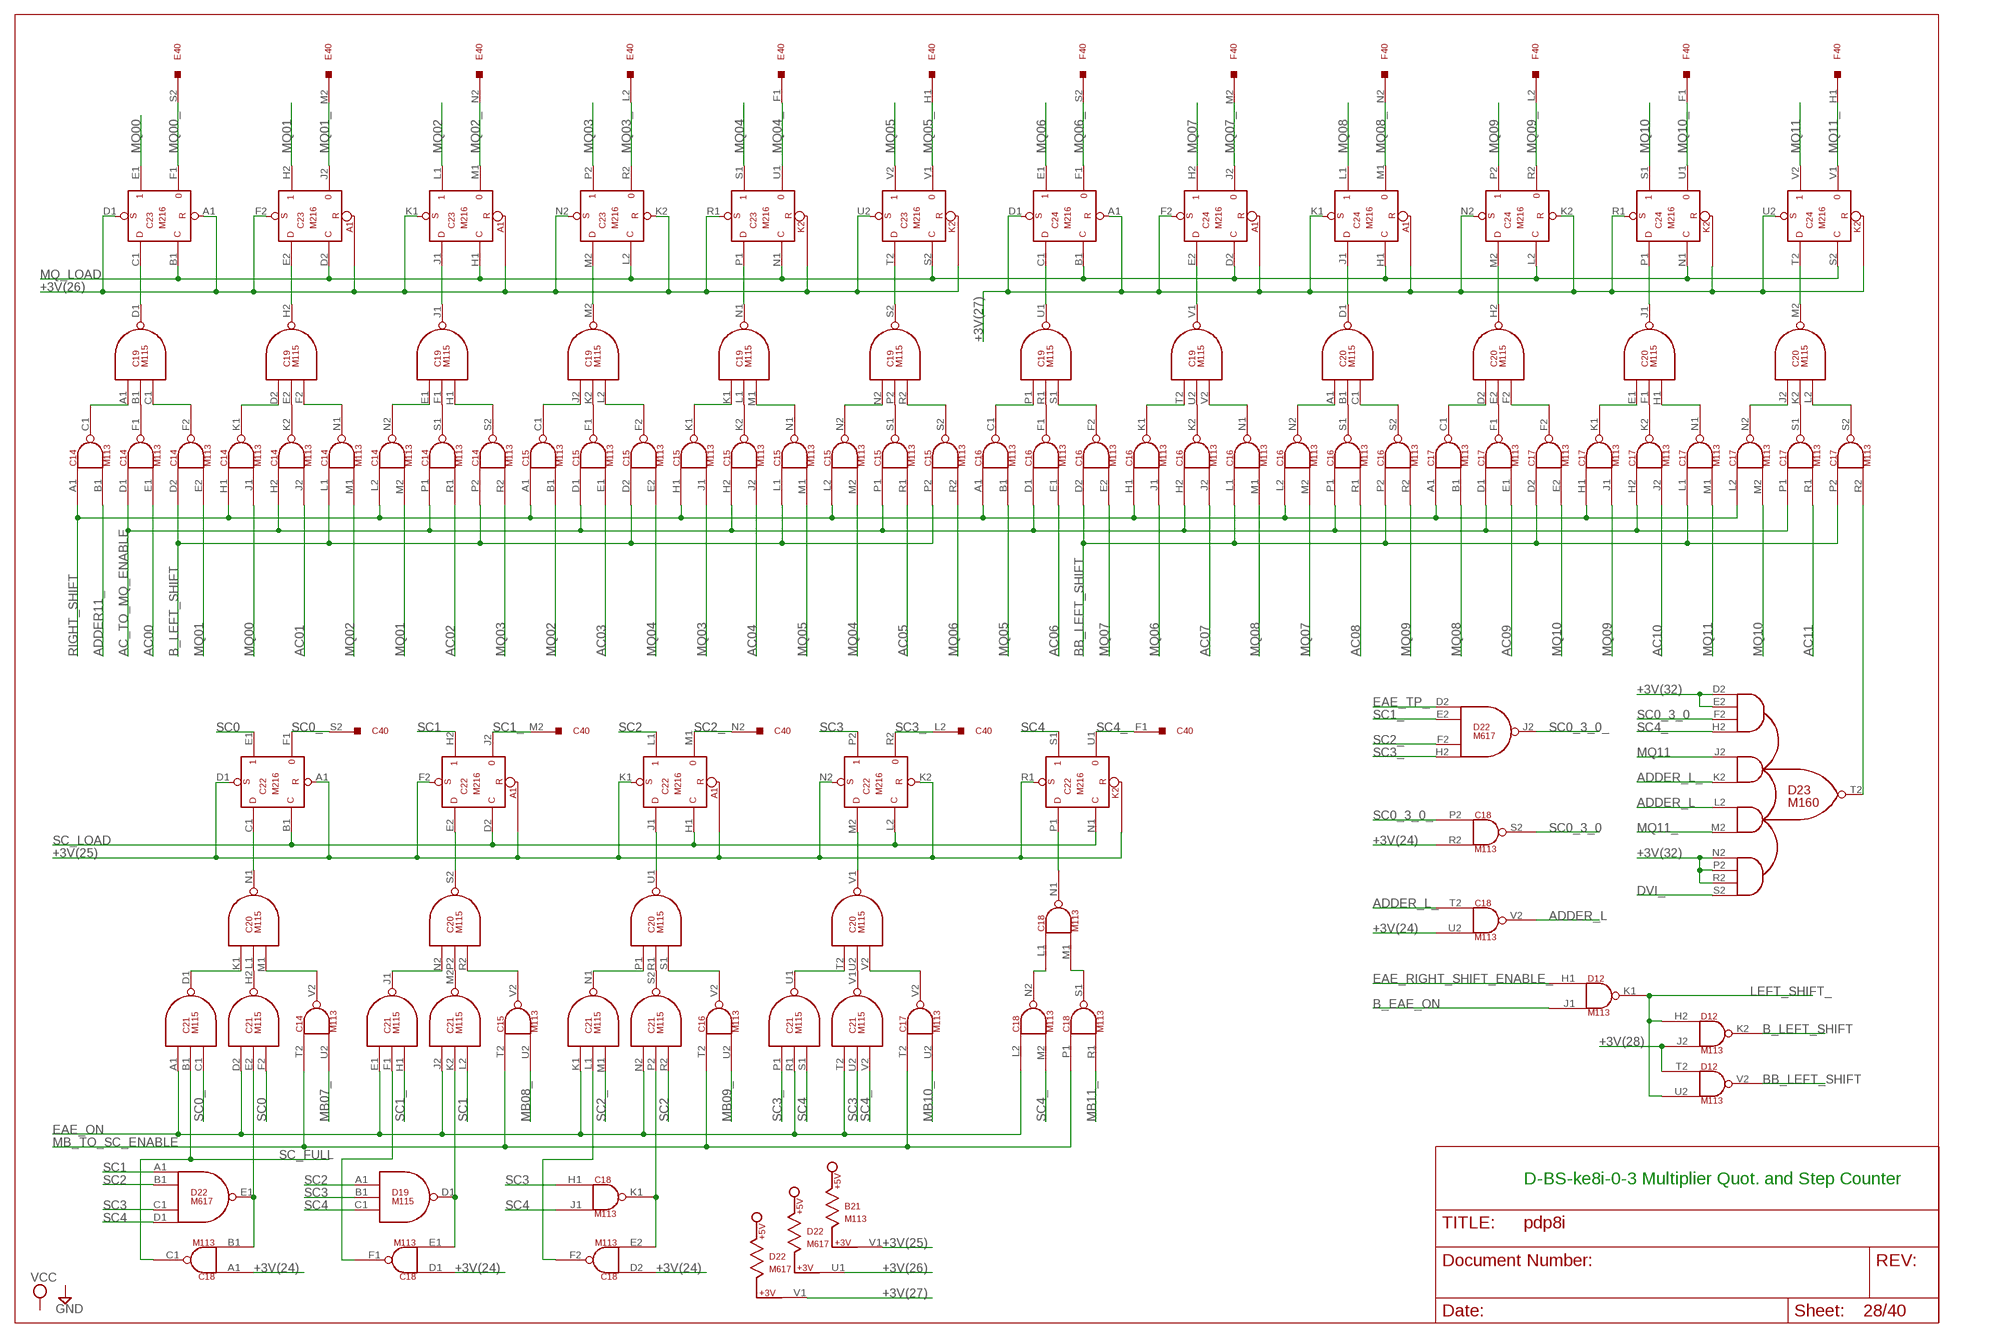
[diagram p28: schematic, sheet 28]

### Parts
C14  M113  [H807]
C15  M113  [H807]
C16  M113  [H807]
C17  M113  [H807]
C19  M115  [H807]
C20  M115  [H807]
C21  M115  [H807]
C23  M216  [H807]
C24  M216  [H807]

### Nets
+3V(24): C18.A1(C1:IN1) C18.D1(F1:IN1) C18.D2(F2:IN1) C18.R2(S2:IN2) C18.U2(V2:IN2) ; also sheet 27
+3V(25): B21.V1 C22.A1(E1:R) C22.D1(E1:S) C22.F2(H2:S) C22.K1(L1:S) C22.K2(P2:R) C22.N2(P2:S) C22.R1(S1:S)
+3V(26): C23.A1(E1:R) C23.D1(E1:S) C23.F2(H2:S) C23.K1(L1:S) C23.K2(P2:R) C23.N2(P2:S) C23.R1(S1:S) C23.U2(V2:S) D22.U1
+3V(27): C24.A1(E1:R) C24.D1(E1:S) C24.F2(H2:S) C24.K1(L1:S) C24.K2(P2:R) C24.N2(P2:S) C24.R1(S1:S) C24.U2(V2:S) D22.V1
+3V(28): D12.J2(K2:IN2) D12.T2(V2:IN1) ; also sheet 27
+3V(32): D23.D2(T2:IN1A) D23.E2(T2:IN1B) D23.N2(T2:IN4A) D23.P2(T2:IN4B) D23.R2(T2:IN4C) ; also sheet 27
AC00: C14.E1(F1:IN2) ; also sheet 7,9,14,27,37
AC01: C14.J2(K2:IN2) ; also sheet 9,14,27,37
AC02: C14.R1(S1:IN2) ; also sheet 9,14,27,33,37
AC03: C15.E1(F1:IN2) ; also sheet 9,14,33,37
AC04: C15.J2(K2:IN2) ; also sheet 9,14,16,33,35,37
AC05: C15.R1(S1:IN2) ; also sheet 9,14,16,33,35,37
AC06: C16.E1(F1:IN2) ; also sheet 9,14,16,33,35,37
AC07: C16.J2(K2:IN2) ; also sheet 9,14,16,33,35,37
AC08: C16.R1(S1:IN2) ; also sheet 9,14,16,33,35,37
AC09: C17.E1(F1:IN2) ; also sheet 9,14,16,33,35,37
AC10: C17.J2(K2:IN2) ; also sheet 9,14,16,33,35,37
AC11: C17.R1(S1:IN2) ; also sheet 9,14,16,33,35,37
AC_TO_MQ_ENABLE: C14.D1(F1:IN1) C14.H2(K2:IN1) C14.P1(S1:IN1) C15.D1(F1:IN1) C15.H2(K2:IN1) C15.P1(S1:IN1) C16.D1(F1:IN1) C16.H2(K2:IN1) C16.P1(S1:IN1) C17.D1(F1:IN1) C17.H2(K2:IN1) C17.P1(S1:IN1) ; also sheet 27
ADDER11_: C14.B1(C1:IN2) ; also sheet 9
ADDER_L: C18.V2(V2:OUT) D23.L2(T2:IN3A) ; also sheet 27
ADDER_L_: C18.T2(V2:IN1) D23.K2(T2:IN2B) ; also sheet 9,10,13
B_EAE_ON: D12.J1(K1:IN2) ; also sheet 9,27
B_LEFT_SHIFT: C14.D2(F2:IN1) C14.L1(N1:IN1) C14.P2(S2:IN1) C15.D2(F2:IN1) C15.L1(N1:IN1) C15.P2(S2:IN1) D12.K2(K2:OUT)
BB_LEFT_SHIFT: C16.D2(F2:IN1) C16.L1(N1:IN1) C16.P2(S2:IN1) C17.D2(F2:IN1) C17.L1(N1:IN1) C17.P2(S2:IN1) D12.V2(V2:OUT)
DVI_: D23.S2(T2:IN4D) ; also sheet 27
EAE_ON: C18.L2(N2:IN1) C21.A1(D1:IN1) C21.D2(H2:IN1) C21.E1(J1:IN1) C21.J2(M2:IN1) C21.K1(N1:IN1) C21.N2(S2:IN1) C21.R1(U1:IN2) C21.T2(V1:IN1) ; also sheet 27
EAE_RIGHT_SHIFT_ENABLE_: D12.H1(K1:IN1) ; also sheet 6,27
EAE_TP_: D22.D2(J2:IN1) ; also sheet 7,27
LEFT_SHIFT_: D12.H2(K2:IN1) D12.K1(K1:OUT) D12.U2(V2:IN2)
MB07_: C14.U2(V2:IN2) ; also sheet 5,8,9,14,16,18,22,23,26,29,30,32,33,34,36
MB08_: C15.U2(V2:IN2) ; also sheet 6,7,8,9,14,16,18,22,23,26,29,30,32,33,34,35
MB09_: C16.U2(V2:IN2) ; also sheet 6,9,18,23,26,27,30,33,37
MB10_: C17.U2(V2:IN2) ; also sheet 6,8,9,18,22,23,26,27,30,37
MB11_: C18.R1(S1:IN2) ; also sheet 2,5,7,8,9,18,22,23,26,29,30
MB_TO_SC_ENABLE: C14.T2(V2:IN1) C15.T2(V2:IN1) C16.T2(V2:IN1) C17.T2(V2:IN1) C18.P1(S1:IN1) ; also sheet 27
MQ00: C14.J1(K1:IN2) C23.E1 ; also sheet 10,27
MQ00_: C23.F1 E40.S2 ; also sheet 27
MQ01: C14.E2(F2:IN2) C14.M2(N2:IN2) C23.H2 ; also sheet 10
MQ01_: C23.J2 E40.M2 ; also sheet 27
MQ02: C14.M1(N1:IN2) C15.B1(C1:IN2) C23.L1 ; also sheet 10
MQ02_: C23.M1 E40.N2 ; also sheet 27
MQ03: C14.R2(S2:IN2) C15.J1(K1:IN2) C23.P2 ; also sheet 11
MQ03_: C23.R2 E40.L2 ; also sheet 27
MQ04: C15.E2(F2:IN2) C15.M2(N2:IN2) C23.S1 ; also sheet 11
MQ04_: C23.U1 E40.F1 ; also sheet 27
MQ05: C15.M1(N1:IN2) C16.B1(C1:IN2) C23.V2 ; also sheet 11
MQ05_: C23.V1 E40.H1 ; also sheet 27
MQ06: C15.R2(S2:IN2) C16.J1(K1:IN2) C24.E1 ; also sheet 12
MQ06_: C24.F1 F40.S2 ; also sheet 27
MQ07: C16.E2(F2:IN2) C16.M2(N2:IN2) C24.H2 ; also sheet 12
MQ07_: C24.J2 F40.M2 ; also sheet 27
MQ08: C16.M1(N1:IN2) C17.B1(C1:IN2) C24.L1 ; also sheet 12
MQ08_: C24.M1 F40.N2 ; also sheet 27
MQ09: C16.R2(S2:IN2) C17.J1(K1:IN2) C24.P2 ; also sheet 13
MQ09_: C24.R2 F40.L2 ; also sheet 27
MQ10: C17.E2(F2:IN2) C17.M2(N2:IN2) C24.S1 ; also sheet 13,27
MQ10_: C24.U1 F40.F1 ; also sheet 27
MQ11: C17.M1(N1:IN2) C24.V2 D23.J2(T2:IN2A) ; also sheet 13,27
MQ11_: C24.V1 D23.M2(T2:IN3B) F40.H1 ; also sheet 27
MQ_LOAD: C23.B1(E1:C) C23.D2(H2:C) C23.H1(L1:C) C23.L2(P2:C) C23.N1(S1:C) C23.S2(V2:C) C24.B1(E1:C) C24.D2(H2:C) C24.H1(L1:C) C24.L2(P2:C) C24.N1(S1:C) C24.S2(V2:C) ; also sheet 27
N$610: C14.F1(F1:OUT) C19.B1(D1:IN2)
N$611: C14.K2(K2:OUT) C19.E2(H2:IN2)
N$612: C14.S1(S1:OUT) C19.F1(J1:IN2)
N$613: C15.F1(F1:OUT) C19.K2(M2:IN2)
N$614: C15.K2(K2:OUT) C19.L1(N1:IN2)
N$615: C15.S1(S1:OUT) C19.P2(S2:IN2)
N$616: C16.F1(F1:OUT) C19.R1(U1:IN2)
N$617: C16.K2(K2:OUT) C19.U2(V1:IN2)
N$618: C16.S1(S1:OUT) C20.B1(D1:IN2)
N$619: C17.F1(F1:OUT) C20.E2(H2:IN2)
N$620: C17.K2(K2:OUT) C20.F1(J1:IN2)
N$621: C17.S1(S1:OUT) C20.K2(M2:IN2)
N$622: C14.C1(C1:OUT) C19.A1(D1:IN1)
N$623: C14.F2(F2:OUT) C19.C1(D1:IN3)
N$624: C14.K1(K1:OUT) C19.D2(H2:IN1)
N$625: C14.N1(N1:OUT) C19.F2(H2:IN3)
N$626: C14.N2(N2:OUT) C19.E1(J1:IN1)
N$627: C14.S2(S2:OUT) C19.H1(J1:IN3)
N$628: C15.C1(C1:OUT) C19.J2(M2:IN1)
N$629: C15.F2(F2:OUT) C19.L2(M2:IN3)
N$630: C15.K1(K1:OUT) C19.K1(N1:IN1)
N$631: C15.N1(N1:OUT) C19.M1(N1:IN3)
N$632: C15.N2(N2:OUT) C19.N2(S2:IN1)
N$633: C15.S2(S2:OUT) C19.R2(S2:IN3)
N$634: C16.C1(C1:OUT) C19.P1(U1:IN1)
N$635: C16.F2(F2:OUT) C19.S1(U1:IN3)
N$636: C16.K1(K1:OUT) C19.T2(V1:IN1)
N$637: C16.N1(N1:OUT) C19.V2(V1:IN3)
N$638: C16.N2(N2:OUT) C20.A1(D1:IN1)
N$639: C16.S2(S2:OUT) C20.C1(D1:IN3)
N$640: C17.C1(C1:OUT) C20.D2(H2:IN1)
N$641: C17.F2(F2:OUT) C20.F2(H2:IN3)
N$642: C17.K1(K1:OUT) C20.E1(J1:IN1)
N$643: C17.N1(N1:OUT) C20.H1(J1:IN3)
N$644: C17.N2(N2:OUT) C20.J2(M2:IN1)
N$645: C17.S2(S2:OUT) C20.L2(M2:IN3)
N$646: C19.D1(D1:OUT) C23.C1(E1:D)
N$647: C19.H2(H2:OUT) C23.E2(H2:D)
N$648: C19.J1(J1:OUT) C23.J1(L1:D)
N$649: C19.M2(M2:OUT) C23.M2(P2:D)
N$650: C19.N1(N1:OUT) C23.P1(S1:D)
N$651: C19.S2(S2:OUT) C23.T2(V2:D)
N$652: C19.U1(U1:OUT) C24.C1(E1:D)
N$653: C19.V1(V1:OUT) C24.E2(H2:D)
N$654: C20.D1(D1:OUT) C24.J1(L1:D)
N$655: C20.H2(H2:OUT) C24.M2(P2:D)
N$656: C20.J1(J1:OUT) C24.P1(S1:D)
N$657: C20.M2(M2:OUT) C24.T2(V2:D)
N$658: C20.L1(N1:IN2) C21.H2(H2:OUT)
N$659: C20.K1(N1:IN1) C21.D1(D1:OUT)
N$660: C14.V2(V2:OUT) C20.M1(N1:IN3)
N$661: C20.N1(N1:OUT) C22.C1(E1:D)
N$662: C18.L1(N1:IN1) C18.N2(N2:OUT)
N$663: C18.M1(N1:IN2) C18.S1(S1:OUT)
N$664: C20.S2(S2:OUT) C22.E2(H2:D)
N$665: C20.U1(U1:OUT) C22.J1(L1:D)
N$666: C20.V1(V1:OUT) C22.M2(P2:D)
N$667: C18.N1(N1:OUT) C22.P1(S1:D)
N$668: C20.N2(S2:IN1) C21.J1(J1:OUT)
N$669: C20.P1(U1:IN1) C21.N1(N1:OUT)
N$670: C20.T2(V1:IN1) C21.U1(U1:OUT)
N$671: C20.P2(S2:IN2) C21.M2(M2:OUT)
N$672: C20.R1(U1:IN2) C21.S2(S2:OUT)
N$673: C20.U2(V1:IN2) C21.V1(V1:OUT)
N$674: C15.V2(V2:OUT) C20.R2(S2:IN3)
N$675: C16.V2(V2:OUT) C20.S1(U1:IN3)
N$676: C17.V2(V2:OUT) C20.V2(V1:IN3)
N$677: C18.B1(C1:IN2) C21.E2(H2:IN2) D22.E1(E1:OUT)
N$678: C18.E1(F1:IN2) C21.K2(M2:IN2) D19.D1(D1:OUT)
N$679: C18.F1(F1:OUT) C21.F1(J1:IN2)
N$680: C18.E2(F2:IN2) C18.K1(K1:OUT) C21.P2(S2:IN2)
N$681: C18.F2(F2:OUT) C21.L1(N1:IN2)
N$682: C17.R2(S2:IN2) D23.T2(T2:OUT)
RIGHT_SHIFT: C14.A1(C1:IN1) C14.H1(K1:IN1) C14.L2(N2:IN1) C15.A1(C1:IN1) C15.H1(K1:IN1) C15.L2(N2:IN1) C16.A1(C1:IN1) C16.H1(K1:IN1) C16.L2(N2:IN1) C17.A1(C1:IN1) C17.H1(K1:IN1) C17.L2(N2:IN1) ; also sheet 6,9,10,11,12,13
SC0: C21.F2(H2:IN3) C22.E1 ; also sheet 12,27
SC0_: C21.C1(D1:IN3) C22.F1 C40.S2
SC0_3_0: C18.S2(S2:OUT) D23.F2(T2:IN1C) ; also sheet 27
SC0_3_0_: C18.P2(S2:IN1) D22.J2(J2:OUT) ; also sheet 27
SC1: C21.L2(M2:IN3) C22.H2 D22.A1(E1:IN1) ; also sheet 12,27
SC1_: C21.H1(J1:IN3) C22.J2 C40.M2 D22.E2(J2:IN2)
SC2: C21.R2(S2:IN3) C22.L1 D19.A1(D1:IN1) D22.B1(E1:IN2) ; also sheet 13,27
SC2_: C21.M1(N1:IN3) C22.M1 C40.N2 D22.F2(J2:IN3)
SC3: C18.H1(K1:IN1) C21.U2(V1:IN2) C22.P2 D19.B1(D1:IN2) D22.C1(E1:IN3) ; also sheet 13,27
SC3_: C21.P1(U1:IN1) C22.R2 C40.L2 D22.H2(J2:IN4)
SC4: C18.J1(K1:IN2) C21.S1(U1:IN3) C22.S1 D19.C1(D1:IN3) D22.D1(E1:IN4) ; also sheet 13,27
SC4_: C18.M2(N2:IN2) C21.V2(V1:IN3) C22.U1 C40.F1 D23.H2(T2:IN1D) ; also sheet 27
SC_FULL: C18.C1(C1:OUT) C21.B1(D1:IN2) ; also sheet 27
SC_LOAD: C22.B1(E1:C) C22.D2(H2:C) C22.H1(L1:C) C22.L2(P2:C) C22.N1(S1:C) ; also sheet 27
Unconnected: C14.U1 C14.V1 C15.U1 C15.V1 C16.U1 C16.V1 C17.U1 C17.V1

### Notes on the sheet
- D-BS-ke8i-0-3 Multiplier Quot. and Step Counter

## Sheet 29 of 40
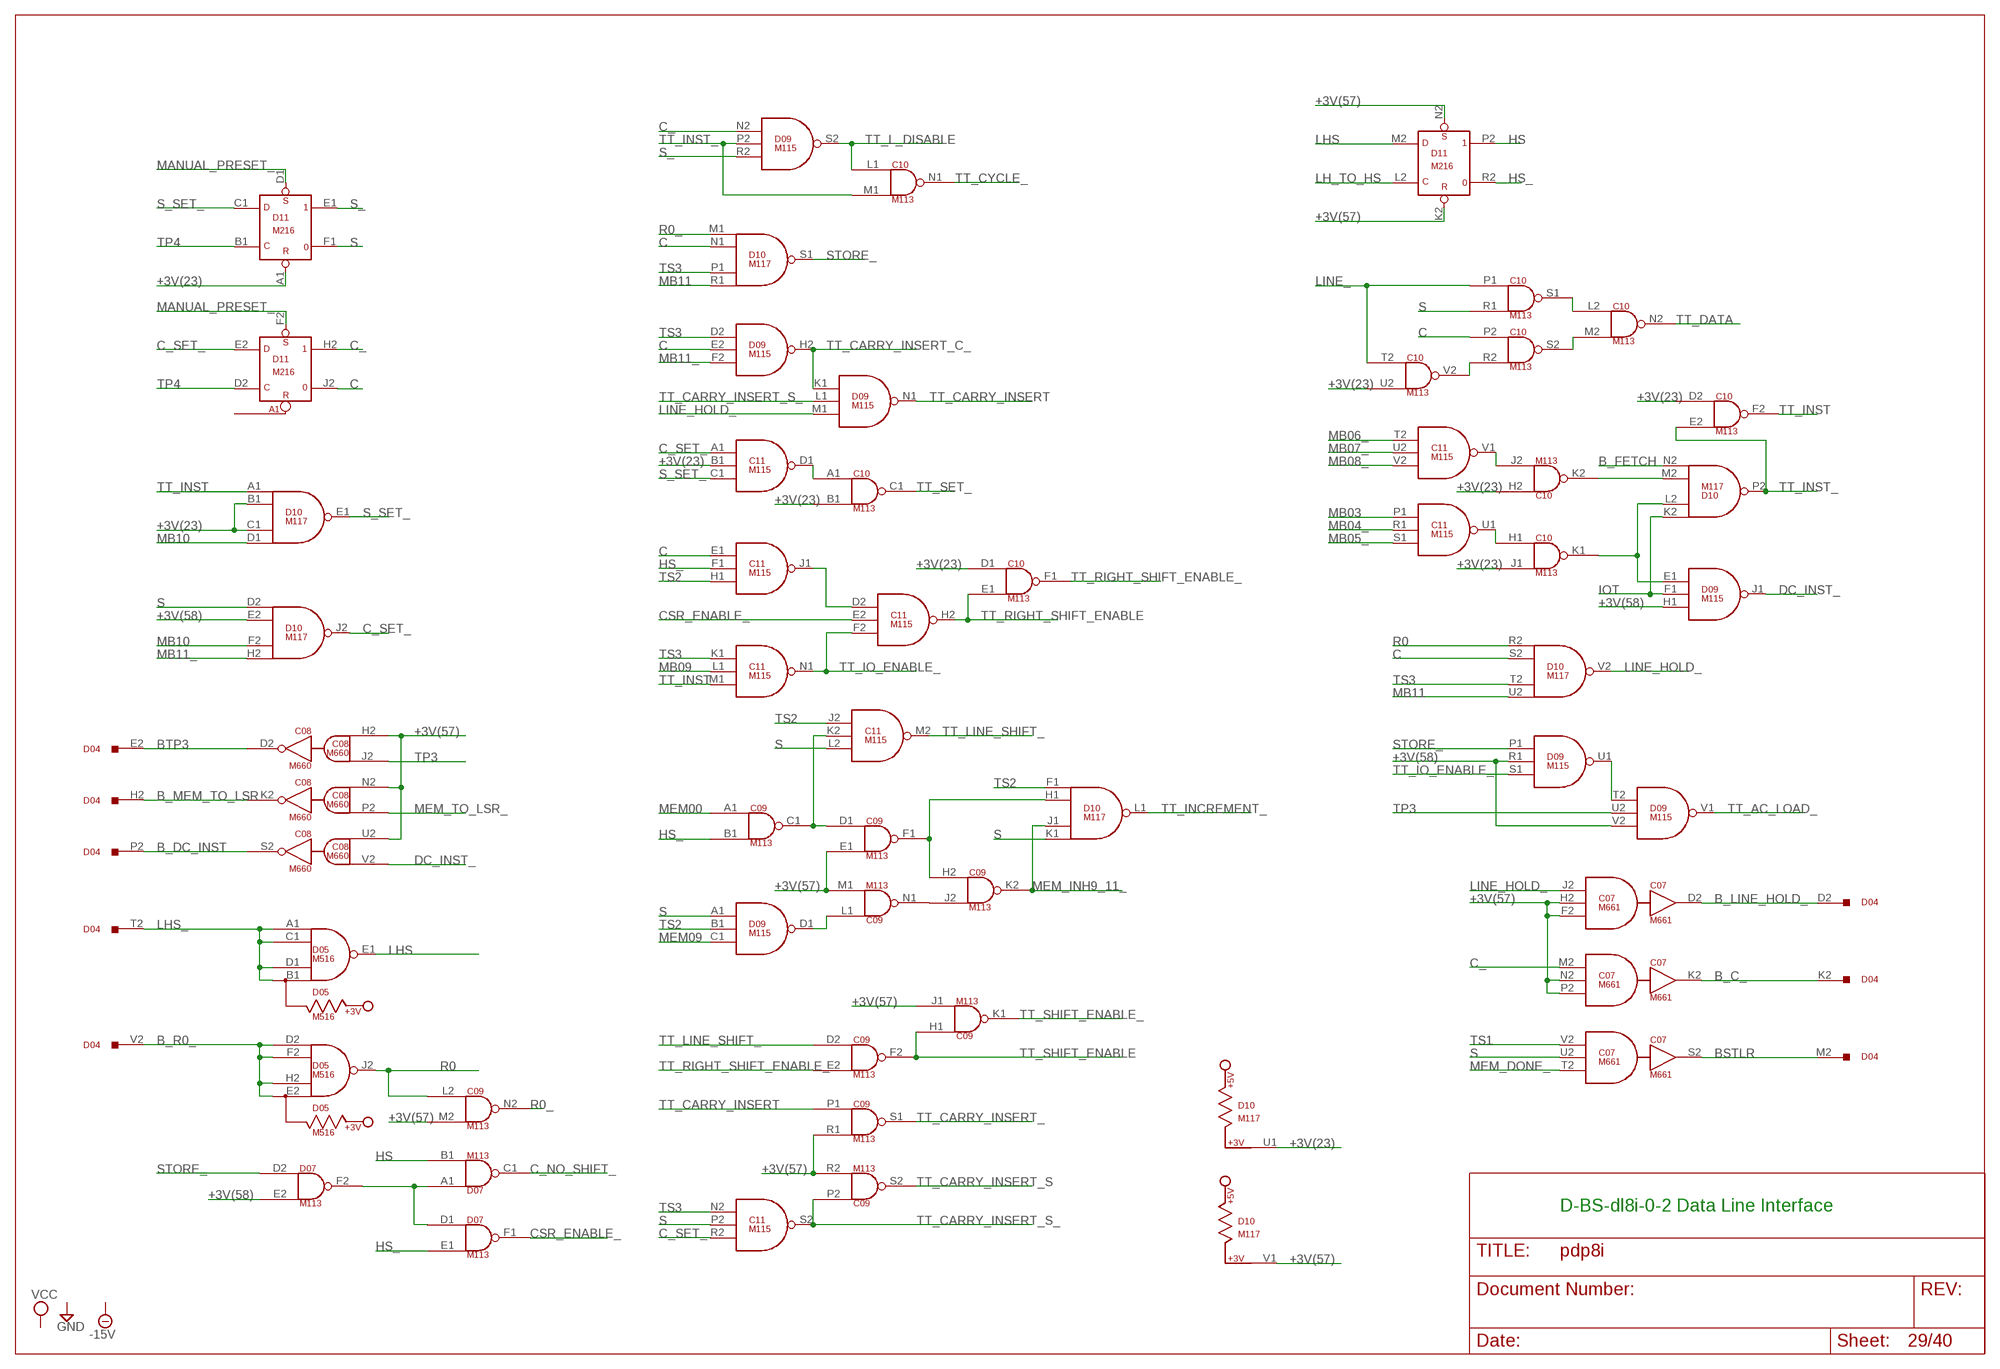
[diagram p29: schematic, sheet 29]

### Parts
C07  M661  [H807]
C08  M660  [H807]
C09  M113  [H807]
C10  M113  [H807]
C11  M115  [H807]
D04  W011  [H807]
D05  M516  [H807]
D09  M115  [H807]
D10  M117  [H807]
D11  M216  [H807]

### Nets
+3V(23): C10.B1(C1:IN2) C10.D1(F1:IN1) C10.D2(F2:IN1) C10.H2(K2:IN1) C10.J1(K1:IN2) C10.U2(V2:IN2) C11.B1(D1:IN2) D10.B1(E1:IN2) D10.C1(E1:IN3) D10.U1 D11.A1(E1:R)
+3V(57): C07.F2(D:IN3) C07.H2(D:IN2) C07.N2(K:IN2) C07.P2(K:IN3) C08.H2(D:IN1) C08.N2(K:IN1) C08.U2(S:IN1) C09.E1(F1:IN2) C09.J1(K1:IN2) C09.M1(N1:IN2) C09.M2(N2:IN2) C09.R1(S1:IN2) C09.R2(S2:IN2) D10.V1 D11.K2(P2:R) D11.N2(P2:S)
+3V(58): D07.E2(F2:IN2) D09.H1(J1:IN3) D09.R1(U1:IN2) D09.V2(V1:IN3) D10.E2(J2:IN2) ; also sheet 2,3,17
B_C_: C07.K2(K:OUT) D04.K2
B_DC_INST: C08.S2(S:OUT) D04.P2
B_FETCH: D10.N2(P2:IN4) ; also sheet 2,4,5,6,7,8,22,27
B_LINE_HOLD_: C07.D2(D:OUT) D04.D2
B_MEM_TO_LSR: C08.K2(K:OUT) D04.H2
B_R0_: D04.V2 D05.D2(J2:IN) D05.E2(J2:IN2) D05.F2(J2:IN3) D05.H2(J2:IN4)
BSTLR: C07.S2(S:OUT) D04.M2
BTP3: C08.D2(D:OUT) D04.E2
C: C10.P2(S2:IN1) C11.E1(J1:IN1) D09.E2(H2:IN2) D10.N1(S1:IN2) D10.S2(V2:IN2) D11.J2
C_: C07.M2(K:IN1) D09.N2(S2:IN1) D11.H2
C_NO_SHIFT_: D07.C1(C1:OUT) ; also sheet 6
C_SET_: C11.A1(D1:IN1) C11.R2(S2:IN3) D10.J2(J2:OUT) D11.E2(H2:D)
CSR_ENABLE_: C11.E2(H2:IN2) D07.F1(F1:OUT)
DC_INST_: C08.V2(S:IN2) D09.J1(J1:OUT)
HS: D07.B1(C1:IN2) D11.P2
HS_: C09.B1(C1:IN2) C11.F1(J1:IN2) D07.E1(F1:IN2) D11.R2
IOT: D09.F1(J1:IN2) D10.K2(P2:IN1) ; also sheet 2,4,7,8,22
LH_TO_HS: D11.L2(P2:C) ; also sheet 3
LHS: D05.E1(E1:OUT) D11.M2(P2:D)
LHS_: D04.T2 D05.A1(E1:IN) D05.B1(E1:IN2) D05.C1(E1:IN3) D05.D1(E1:IN4)
LINE_: C10.P1(S1:IN1) C10.T2(V2:IN1) ; also sheet 14
LINE_HOLD_: C07.J2(D:IN1) D09.M1(N1:IN3) D10.V2(V2:OUT)
MANUAL_PRESET_: D11.D1(E1:S) D11.F2(H2:S) ; also sheet 2,4,8,21
MB03: C11.P1(U1:IN1) ; also sheet 4,5,9,14,21,27,30,34,38
MB04_: C11.R1(U1:IN2) ; also sheet 5,8,9,14,15,16,18,23,27,30,32,33,34,35,36,37
MB05_: C11.S1(U1:IN3) ; also sheet 5,8,9,14,15,16,18,22,23,30,33,35,36,38
MB06_: C11.T2(V1:IN1) ; also sheet 5,8,9,14,15,18,22,23,30,32,34,35,36,37,38
MB07_: C11.U2(V1:IN2) ; also sheet 5,8,9,14,16,18,22,23,26,28,30,32,33,34,36
MB08_: C11.V2(V1:IN3) ; also sheet 6,7,8,9,14,16,18,22,23,26,28,30,32,33,34,35
MB09: C11.L1(N1:IN2) ; also sheet 2,5,6,9,14,21,22,27,30,37
MB10: D10.D1(E1:IN4) D10.F2(J2:IN3) ; also sheet 2,6,8,9,14,21,22,27,30,33,37
MB11: D10.R1(S1:IN4) D10.U2(V2:IN4) ; also sheet 2,6,9,14,21,22,27,30,33,37
MB11_: D09.F2(H2:IN3) D10.H2(J2:IN4) ; also sheet 2,5,7,8,9,18,22,23,26,28,30
MEM00: C09.A1(C1:IN1) ; also sheet 4,10,18,31
MEM09: D09.C1(D1:IN3) ; also sheet 13,18,31
MEM_DONE_: C07.T2(S:IN3) ; also sheet 2,8,17,21
MEM_INH9_11_: C09.K2(K2:OUT) D10.J1(L1:IN3) ; also sheet 5
MEM_TO_LSR_: C08.P2(K:IN2) ; also sheet 3
N$725: D07.A1(C1:IN1) D07.D1(F1:IN1) D07.F2(F2:OUT)
N$726: C09.L1(N1:IN1) D09.D1(D1:OUT)
N$727: C09.J2(K2:IN2) C09.N1(N1:OUT)
N$728: C09.C1(C1:OUT) C09.D1(F1:IN1) C11.K2(M2:IN2)
N$729: C09.F1(F1:OUT) C09.H2(K2:IN1) D10.H1(L1:IN2)
N$730: C11.D2(H2:IN1) C11.J1(J1:OUT)
N$731: C10.A1(C1:IN1) C11.D1(D1:OUT)
N$732: D09.T2(V1:IN1) D09.U1(U1:OUT)
N$733: C10.K1(K1:OUT) D09.E1(J1:IN1) D10.L2(P2:IN2)
N$742: C10.H1(K1:IN1) C11.U1(U1:OUT)
N$743: C10.J2(K2:IN2) C11.V1(V1:OUT)
N$744: C10.K2(K2:OUT) D10.M2(P2:IN3)
N$745: C10.R2(S2:IN2) C10.V2(V2:OUT)
N$746: C10.L2(N2:IN1) C10.S1(S1:OUT)
N$747: C10.M2(N2:IN2) C10.S2(S2:OUT)
R0: C09.L2(N2:IN1) D05.J2(J2:OUT) D10.R2(V2:IN1)
R0_: C09.N2(N2:OUT) D10.M1(S1:IN1)
S: C07.U2(S:IN2) C10.R1(S1:IN2) C11.L2(M2:IN3) C11.P2(S2:IN2) D09.A1(D1:IN1) D10.D2(J2:IN1) D10.K1(L1:IN4) D11.F1 ; also sheet 3,17
S_: D09.R2(S2:IN3) D11.E1 ; also sheet 3,17
S_SET_: C11.C1(D1:IN3) D10.E1(E1:OUT) D11.C1(E1:D)
STORE_: D07.D2(F2:IN1) D09.P1(U1:IN1) D10.S1(S1:OUT) ; also sheet 5
TP3: C08.J2(D:IN2) D09.U2(V1:IN2) ; also sheet 2,7,21,22,26,27,30
TP4: D11.B1(E1:C) D11.D2(H2:C) ; also sheet 2,4,7,8
TS1: C07.V2(S:IN1) ; also sheet 2,5,6
TS2: C11.H1(J1:IN3) C11.J2(M2:IN1) D09.B1(D1:IN2) D10.F1(L1:IN1) ; also sheet 2,5,6,7
TS3: C11.K1(N1:IN1) C11.N2(S2:IN1) D09.D2(H2:IN1) D10.P1(S1:IN3) D10.T2(V2:IN3) ; also sheet 2,5,6,22
TT_AC_LOAD_: D09.V1(V1:OUT) ; also sheet 7
TT_CARRY_INSERT: C09.P1(S1:IN1) D09.N1(N1:OUT) ; also sheet 7
TT_CARRY_INSERT_: C09.S1(S1:OUT) ; also sheet 5,6
TT_CARRY_INSERT_C_: D09.H2(H2:OUT) D09.K1(N1:IN1)
TT_CARRY_INSERT_S: C09.S2(S2:OUT) ; also sheet 13
TT_CARRY_INSERT_S_: C09.P2(S2:IN1) C11.S2(S2:OUT) D09.L1(N1:IN2)
TT_CYCLE_: C10.N1(N1:OUT) ; also sheet 6
TT_DATA: C10.N2(N2:OUT) ; also sheet 9
TT_INCREMENT_: D10.L1(L1:OUT) ; also sheet 6
TT_INST: C10.F2(F2:OUT) C11.M1(N1:IN3) D10.A1(E1:IN1)
TT_INST_: C10.E2(F2:IN2) C10.M1(N1:IN2) D09.P2(S2:IN2) D10.P2(P2:OUT) ; also sheet 2,9,14
TT_IO_ENABLE_: C11.F2(H2:IN3) C11.N1(N1:OUT) D09.S1(U1:IN3) ; also sheet 5
TT_L_DISABLE: C10.L1(N1:IN1) D09.S2(S2:OUT) ; also sheet 5
TT_LINE_SHIFT_: C09.D2(F2:IN1) C11.M2(M2:OUT) ; also sheet 10,11,12,13
TT_RIGHT_SHIFT_ENABLE: C10.E1(F1:IN2) C11.H2(H2:OUT)
TT_RIGHT_SHIFT_ENABLE_: C09.E2(F2:IN2) C10.F1(F1:OUT) ; also sheet 6
TT_SET_: C10.C1(C1:OUT) ; also sheet 4,5
TT_SHIFT_ENABLE: C09.F2(F2:OUT) C09.H1(K1:IN1) ; also sheet 9
TT_SHIFT_ENABLE_: C09.K1(K1:OUT) ; also sheet 6
Unconnected: C09.T2(V2:IN1) C09.U1 C09.U2(V2:IN2) C09.V1 C09.V2(V2:OUT) C10.U1 C10.V1 D04.S2 D05.F1(L1:IN) D05.H1(L1:IN2) D05.J1(L1:IN3) D05.K1(L1:IN4) D05.K2(P2:IN) D05.L1(L1:OUT) D05.L2(P2:IN2) D05.M1(S1:IN) D05.M2(P2:IN3) D05.N1(S1:IN2) D05.N2(P2:IN4) D05.P1(S1:IN3) D05.P2(P2:OUT) D05.R1(S1:IN4) D05.R2(V2:IN) D05.S1(S1:OUT) D05.S2(V2:IN2) D05.T2(V2:IN3) D05.U2(V2:IN4) D05.V2(V2:OUT) D09.J2(M2:IN1) D09.K2(M2:IN2) D09.L2(M2:IN3) D09.M2(M2:OUT) D11.H1(L1:C) D11.J1(L1:D) D11.K1(L1:S) D11.L1 D11.M1 D11.N1(S1:C) D11.P1(S1:D) D11.R1(S1:S) D11.S1 D11.S2(V2:C) D11.T2(V2:D) D11.U1 D11.U2(V2:S) D11.V1 D11.V2

### Notes on the sheet
- D-BS-dl8i-0-2 Data Line Interface